# Altium project caijiban.PrjPCB (part 1 of 2)
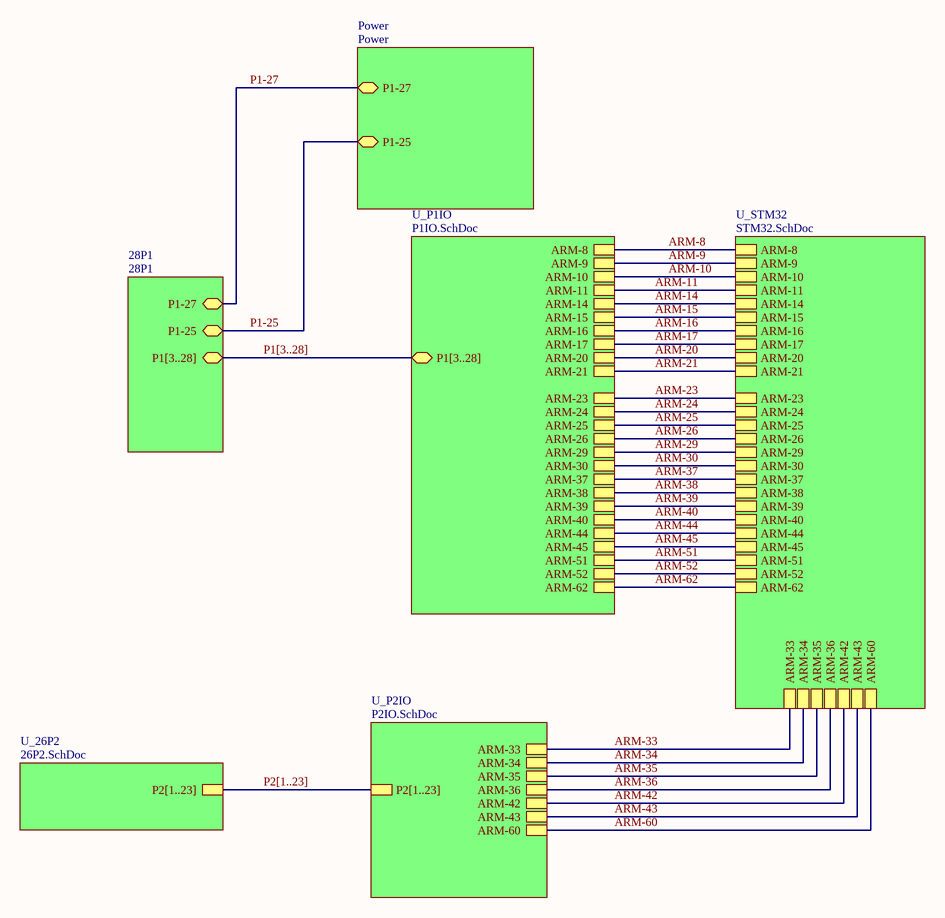
[diagram p0: TOP.SchDoc]
13 sheets, 512 parts. Net scope: global (net labels, ports and power ports of the same name join across sheets).
Sheets:
  TOP.SchDoc
    Power = Power.SchDoc
    28P1 = 28P1.SchDoc
    U_STM32 = STM32.SchDoc
    U_P1IO = P1IO.SchDoc
      U_智能四通道高端开关（1） = 智能四通道高端开关（1）.SchDoc
      U_四通道输出运算放大（2） = 四通道输出运算放大（2）.SchDoc
      U_输出运算放大(3) = 输出运算放大(3).SchDoc
      U_集成隔离器（4） = 集成隔离器（4）.SchDoc
      U_输出运算放大器（5） = 输出运算放大器（5）.SchDoc
      U_输出放大（6） = 输出放大（6）.SchDoc
    U_P2IO = P2IO.SchDoc
    U_26P2 = 26P2.SchDoc

## Sheet TOP.SchDoc
size A4

### Sub-sheets
28P1 = 28P1: P1[3..28], P1-27, P1-25
Power = Power: P1-27, P1-25
U_26P2 = 26P2.SchDoc: P2[1..23]
U_P1IO = P1IO.SchDoc: P1[3..28], ARM-37, ARM-38, ARM-39, ARM-40, ARM-51, ARM-52, ARM-9, ARM-10, ARM-11, ARM-23, ARM-24, ARM-29, ARM-30, ARM-44, ARM-45, ARM-62, ARM-14, ARM-15, ARM-16, ARM-17, ARM-20, ARM-21, ARM-25, ARM-26, ARM-8
U_P2IO = P2IO.SchDoc: ARM-36, ARM-34, ARM-33, ARM-60, P2[1..23], ARM-35, ARM-42, ARM-43
U_STM32 = STM32.SchDoc: ARM-26, ARM-29, ARM-30, ARM-33, ARM-34, ARM-35, ARM-36, ARM-37, ARM-38, ARM-39, ARM-40, ARM-52, ARM-60, ARM-62, ARM-42, ARM-43, ARM-44, ARM-45, ARM-51, ARM-20, ARM-21, ARM-23, ARM-24, ARM-25, ARM-8, ARM-9, ARM-10, ARM-11, ARM-14, ARM-15, ARM-16, ARM-17

### Nets
P1-25: sheet Power/P1-25, sheet 28P1/P1-25
P1-27: sheet Power/P1-27, sheet 28P1/P1-27
ARM-8: sheet U_STM32/ARM-8, sheet U_P1IO/ARM-8
ARM-9: sheet U_STM32/ARM-9, sheet U_P1IO/ARM-9
ARM-10: sheet U_STM32/ARM-10, sheet U_P1IO/ARM-10
ARM-11: sheet U_STM32/ARM-11, sheet U_P1IO/ARM-11
ARM-14: sheet U_STM32/ARM-14, sheet U_P1IO/ARM-14
ARM-15: sheet U_STM32/ARM-15, sheet U_P1IO/ARM-15
ARM-16: sheet U_STM32/ARM-16, sheet U_P1IO/ARM-16
ARM-17: sheet U_STM32/ARM-17, sheet U_P1IO/ARM-17
ARM-20: sheet U_STM32/ARM-20, sheet U_P1IO/ARM-20
ARM-21: sheet U_STM32/ARM-21, sheet U_P1IO/ARM-21
ARM-23: sheet U_STM32/ARM-23, sheet U_P1IO/ARM-23
ARM-24: sheet U_STM32/ARM-24, sheet U_P1IO/ARM-24
ARM-25: sheet U_STM32/ARM-25, sheet U_P1IO/ARM-25
ARM-26: sheet U_STM32/ARM-26, sheet U_P1IO/ARM-26
ARM-29: sheet U_STM32/ARM-29, sheet U_P1IO/ARM-29
ARM-30: sheet U_STM32/ARM-30, sheet U_P1IO/ARM-30
ARM-33: sheet U_STM32/ARM-33, sheet U_P2IO/ARM-33
ARM-34: sheet U_STM32/ARM-34, sheet U_P2IO/ARM-34
ARM-35: sheet U_STM32/ARM-35, sheet U_P2IO/ARM-35
ARM-36: sheet U_STM32/ARM-36, sheet U_P2IO/ARM-36
ARM-37: sheet U_STM32/ARM-37, sheet U_P1IO/ARM-37
ARM-38: sheet U_STM32/ARM-38, sheet U_P1IO/ARM-38
ARM-39: sheet U_STM32/ARM-39, sheet U_P1IO/ARM-39
ARM-40: sheet U_STM32/ARM-40, sheet U_P1IO/ARM-40
ARM-42: sheet U_STM32/ARM-42, sheet U_P2IO/ARM-42
ARM-43: sheet U_STM32/ARM-43, sheet U_P2IO/ARM-43
ARM-44: sheet U_STM32/ARM-44, sheet U_P1IO/ARM-44
ARM-45: sheet U_STM32/ARM-45, sheet U_P1IO/ARM-45
ARM-51: sheet U_STM32/ARM-51, sheet U_P1IO/ARM-51
ARM-52: sheet U_STM32/ARM-52, sheet U_P1IO/ARM-52
ARM-60: sheet U_STM32/ARM-60, sheet U_P2IO/ARM-60
ARM-62: sheet U_STM32/ARM-62, sheet U_P1IO/ARM-62

### Buses and harness runs
bus P1[3..28] = sheet 28P1/P1[3..28] = sheet U_P1IO/P1[3..28]
bus P2[1..23] = sheet U_26P2/P2[1..23] = sheet U_P2IO/P2[1..23]

## Sheet Power.SchDoc: 采集板的电源模块
size A4
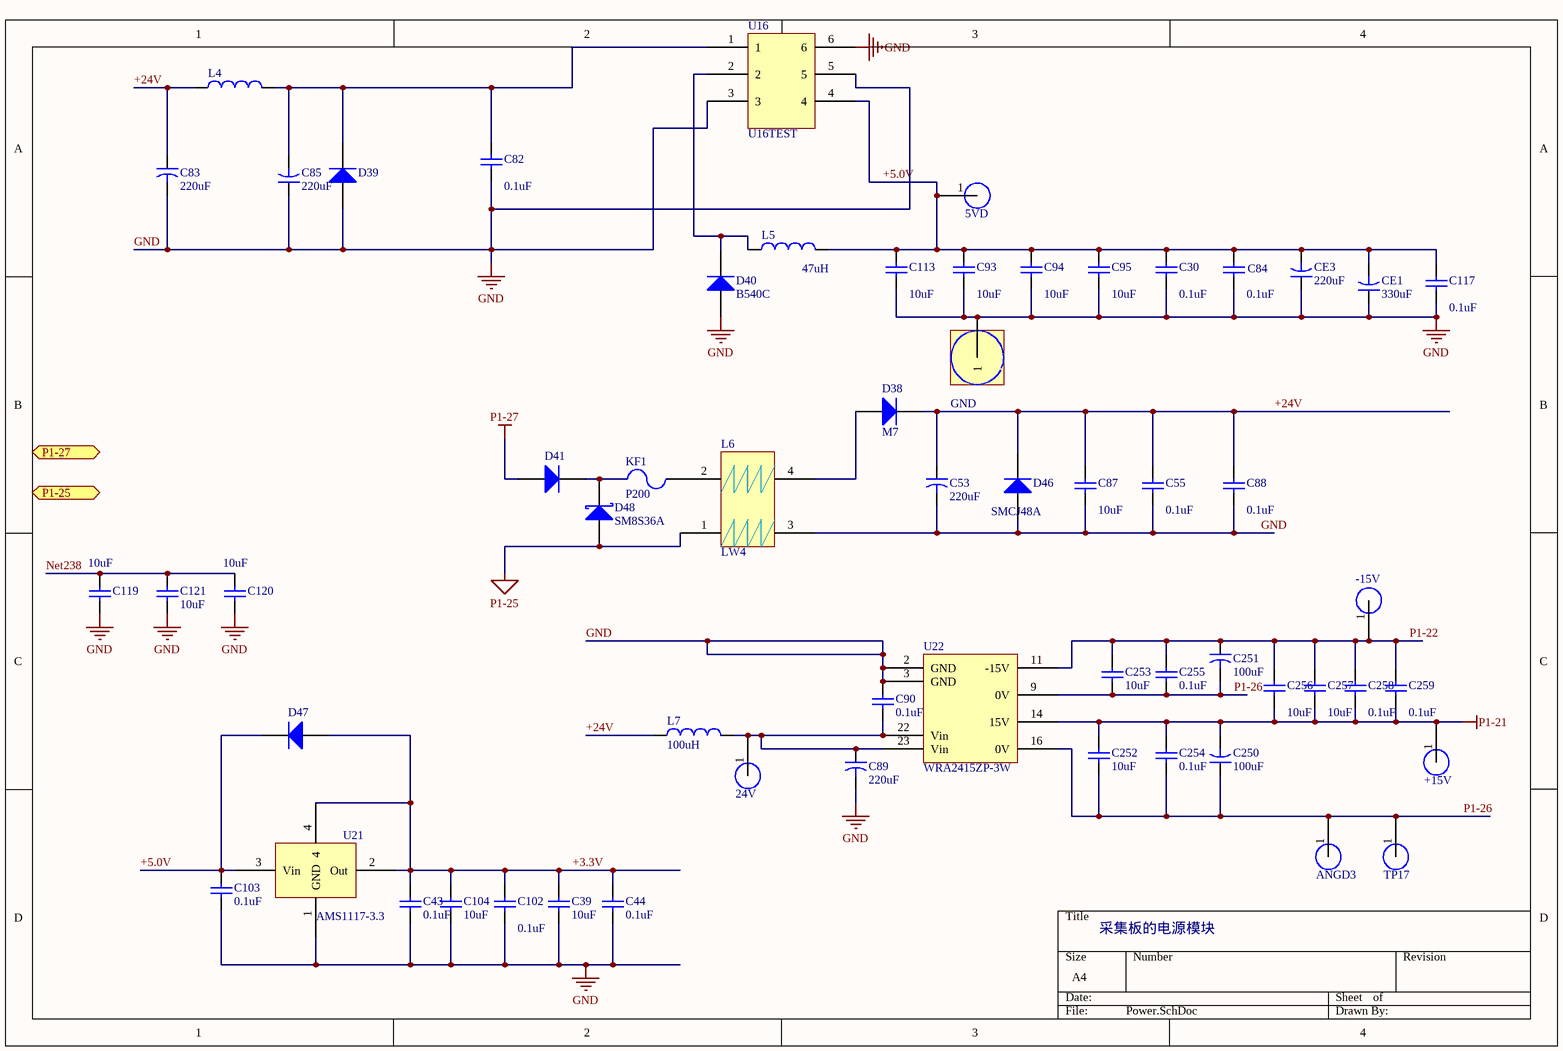
[diagram p1: Power.SchDoc]

### Parts
5VD  PIN  [圆形焊盘]  (value not drawn)
24V  PIN  [圆形焊盘]  (value not drawn)
+15V  PIN  [圆形焊盘]  (value not drawn)
-15V  PIN  [圆形焊盘]  (value not drawn)
ANGD3  PIN  [圆形焊盘]  (value not drawn)
C30  value 0.1uF  [C0805]  (hidden comment: 104/10%)
C39  value 10uF  [C1206]  (hidden comment: Cap)
C43  value 0.1uF  [C0805]  (hidden comment: 104/10%)
C44  value 0.1uF  [C0805]  (hidden comment: Cap)
C53  value 220uF  [8*12]  (hidden comment: Cap2)
C55  value 0.1uF  [C0805]  (hidden comment: 104/10%)
C82  value 0.1uF  [C0805]  (hidden comment: 22pF/5%)
C83  value 220uF  [8*12]  (hidden comment: Cap2)
C84  value 0.1uF  [C0805]  (hidden comment: 104/10%)
C85  value 220uF  [8*12]  (hidden comment: Cap2)
C87  10uF  [C1206]
C88  value 0.1uF  [C0805]  (hidden comment: 104/10%)
C89  value 220uF  [8*12]  (hidden comment: Cap2)
C90  value 0.1uF  [C0805]  (hidden comment: 104/10%)
C93  10uF  [C1206]
C94  10uF  [C1206]
C95  10uF  [C1206]
C102  value 0.1uF  [C0805]  (hidden comment: Cap)
C103  value 0.1uF  [C0805]  (hidden comment: 104/10%)
C104  value 10uF  [C1206]  (hidden comment: Cap)
C113  value 10uF  [C1206]  (hidden comment: Cap)
C117  value 0.1uF  [C0805]  (hidden comment: Cap)
C119  value 10uF  [C1210]  (hidden comment: Cap)
C120  value 10uF  [C1210]  (hidden comment: Cap)
C121  value 10uF  [C1210]  (hidden comment: Cap)
C250  value 100uF  [8*12]  (hidden comment: Cap2)
C251  value 100uF  [8*12]  (hidden comment: Cap2)
C252  10uF  [C1206]
C253  10uF  [C1206]
C254  value 0.1uF  [C0805]  (hidden comment: 104/10%)
C255  value 0.1uF  [C0805]  (hidden comment: 104/10%)
C256  10uF  [C1206]
C257  10uF  [C1206]
C258  value 0.1uF  [C0805]  (hidden comment: 104/10%)
C259  value 0.1uF  [C0805]  (hidden comment: 104/10%)
CE1  value 330uF  [8*12]  (hidden comment: Cap2)
CE3  value 220uF  [8*12]  (hidden comment: Cap2)
D38  M7  [DO214AB]
D39  SMCJ48A  [DO214AB]  (value not drawn)
D40  B540C  [DO214AB]
D41  B540C  [DO214AB]  (value not drawn)
D46  SMCJ48A  [DO214AB]
D47  Diode 1N4007  [SOD123]  (value not drawn)
D48  SM8S36A  [DO-218AB]
GND  TEST  [方形焊盘]  (value not drawn)
KF1  P200  [1812]
L4  101  [7*7]  (value not drawn)
L5  value 47uH  [12.5*12.5]  (hidden comment: SLF12575T-470M2R7-PF)
L6  LW4  [直插共模电感]
L7  value 100uH  [7*7]  (hidden comment: 101)
TP17  PIN  [圆形焊盘]  (value not drawn)
U16  U16TEST  [TOP2-63]
U21  AMS1117-3.3  [SOT-223]
U22  WRA2415ZP-3W  [WRA2415]

### Ports
P1-25, P1-27

### Nets
+3.3V: C39.1 C43.2 C44.1 C102.2 C104.1 D47.1(A) U21.2(Out) U21.4
+5.0V: 5VD.1 C30.1 C84.1 C93.1 C94.1 C95.1 C103.1 C113.2 C117.2 CE1.2 CE3.2 D47.2(K) L5.2 U16.4 U21.3(Vin)
+24V: C53.2 C55.2 C83.2 C87.2 C88.2 D38.2(K) D46.2(K) L4.1 L7.1
GND: C30.2 C39.2 C43.1 C44.2 C53.1 C55.1 C82.1 C83.1 C84.2 C85.1 C87.1 C88.1 C89.1 C90.1 C93.2 C94.2 C95.2 C102.1 C103.2 C104.2 C113.1 C117.1 C119.2 C120.2 C121.1 CE1.1 CE3.1 D39.1(A) D40.1(A) D46.1(A) GND.1 L6.3 U16.3 U16.5 U16.6 U21.1(GND) U22.2(GND) U22.3(GND)
P1-21: +15V.1 C250.2 C252.1 C254.1 C256.1 C257.1 C258.1 C259.1 U22.14(15V)
P1-22: -15V.1 C251.1 C253.1 C255.1 C256.2 C257.2 C258.2 C259.2 U22.11(-15V)
P1-25: D48.2(A) L6.1 ; port P1-25
P1-26: ANGD3.1 C250.1 C251.2 C252.2 C253.2 C254.2 C255.2 TP17.1 U22.9(0V) U22.16(0V)
P1-27: D41.1(A) ; port P1-27
Net238: C119.1 C120.1 C121.2
Net24V_1: 24V.1 C89.2 C90.2 L7.2 U22.22(Vin) U22.23(Vin)
NetC82_2: C82.2 C85.2 D39.2(K) L4.2 U16.1
NetD38_1: D38.1(A) L6.4
NetD40_2: D40.2(K) L5.1 U16.2
NetD41_2: D41.2(K) D48.1(K) KF1.2
NetKF1_1: KF1.1 L6.2

### Library data of the parts
5VD 24V +15V -15V ANGD3 GND TP17 U16 U21 = Component_1
C30 C39 C43 C44 C55 C82 C84 C87 C88 C90 C93-C95 C102-C104 C113 C117 C119-C121 C252-C259 = Cap: Capacitor; Published: 8-Jun-2000; LatestRevisionDate: 17-Jul-2002; LatestRevisionNote: Re-released for DXP Platform.; PackageReference: RAD-0.3; Publisher: Altium Limited
  C87 C93-C95 C252 C253 C256 C257: Value: 10uF
C53 C83 C85 C89 C250 C251 CE1 CE3 = Cap2: Capacitor; Published: 23-Sep-2002; PackageReference: CAPR5-4X5; Publisher: Altium Limited
D38 D40 D41 D47 = Diode 1N4007: 1 Amp General Purpose Rectifier; Published: 8-Jun-2000; LatestRevisionDate: 17-Jul-2002; LatestRevisionNote: Re-released for DXP Platform.; DatasheetDocument: 1998; PackageDocument: Aug-1999; PackageReference: DO-41; Publisher: Altium Limited; Code_JEDEC: DO-204-AL; ComponentLink1Description: Manufacturer Link; ComponentLink1URL: http://www.fairchildsemi.com/; ComponentLink2Description: Datasheet; ComponentLink2URL: http://www.fairchildsemi.com/ds/1N%2F1N4001.pdf
D39 D46 = Diode: Default Diode; Published: 8-Jun-2000; LatestRevisionDate: 17-Jul-2002; LatestRevisionNote: Re-released for DXP Platform.; PackageDocument: Sep-1996; PackageReference: SMC; Publisher: Altium Limited; Code_JEDEC: DO-214-AB
D48 = D Schottky: Schottky Diode; Published: 8-Jun-2000; LatestRevisionDate: 17-Jul-2002; LatestRevisionNote: Re-released for DXP Platform.; PackageReference: SMB; Publisher: Altium Limited; Code_JEDEC: DO-214-AA
KF1 = Fuse 2: Fuse; Published: 8-Jun-2000; LatestRevisionDate: 17-Jul-2002; LatestRevisionNote: Re-released for DXP Platform.; PackageReference: PIN-W2/E2.8; Publisher: Altium Limited
L4 = Inductor: Code_IEC: 1005; Value: 100uH; Published: 8-Jun-2000; LatestRevisionDate: 17-Jul-2002; LatestRevisionNote: Re-released for DXP Platform.; PackageReference: 0402-A; Publisher: Altium Limited; Code_JEITA: 0402
L5 L7 = Inductor: Code_IEC: 1005; Published: 8-Jun-2000; LatestRevisionDate: 17-Jul-2002; LatestRevisionNote: Re-released for DXP Platform.; PackageReference: 0402-A; Publisher: Altium Limited; Code_JEITA: 0402

## Sheet 28P1.SchDoc
size A4
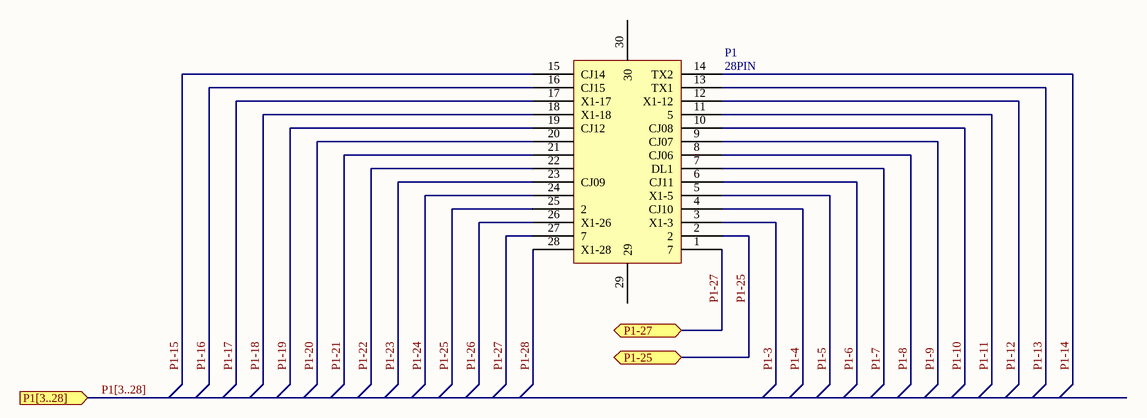
[diagram p2: 28P1.SchDoc]

### Parts
P1  28PIN  [2*14]

### Ports
P1-25, P1-27, P1[3..28]

### Nets
P1-21: P1.21
P1-22: P1.22
P1-25: P1.2 P1.25(2) ; port P1-25
P1-26: P1.26(X1-26)
P1-27: P1.1(7) P1.27(7) ; port P1-27
P1-3: P1.3(X1-3)
P1-4: P1.4(CJ10)
P1-5: P1.5(X1-5)
P1-6: P1.6(CJ11)
P1-7: P1.7(DL1)
P1-8: P1.8(CJ06)
P1-9: P1.9(CJ07)
P1-10: P1.10(CJ08)
P1-11: P1.11(5)
P1-12: P1.12(X1-12)
P1-13: P1.13(TX1)
P1-14: P1.14(TX2)
P1-15: P1.15(CJ14)
P1-16: P1.16(CJ15)
P1-17: P1.17(X1-17)
P1-18: P1.18(X1-18)
P1-19: P1.19(CJ12)
P1-20: P1.20
P1-23: P1.23(CJ09)
P1-24: P1.24
P1-28: P1.28(X1-28)

Not connected (* = marked no-connect by the designer): P1 29 30

### Buses and harness runs
bus P1[3..28] = port P1[3..28]

### Library data of the parts
P1 = Component_1

## Sheet STM32.SchDoc
size A4
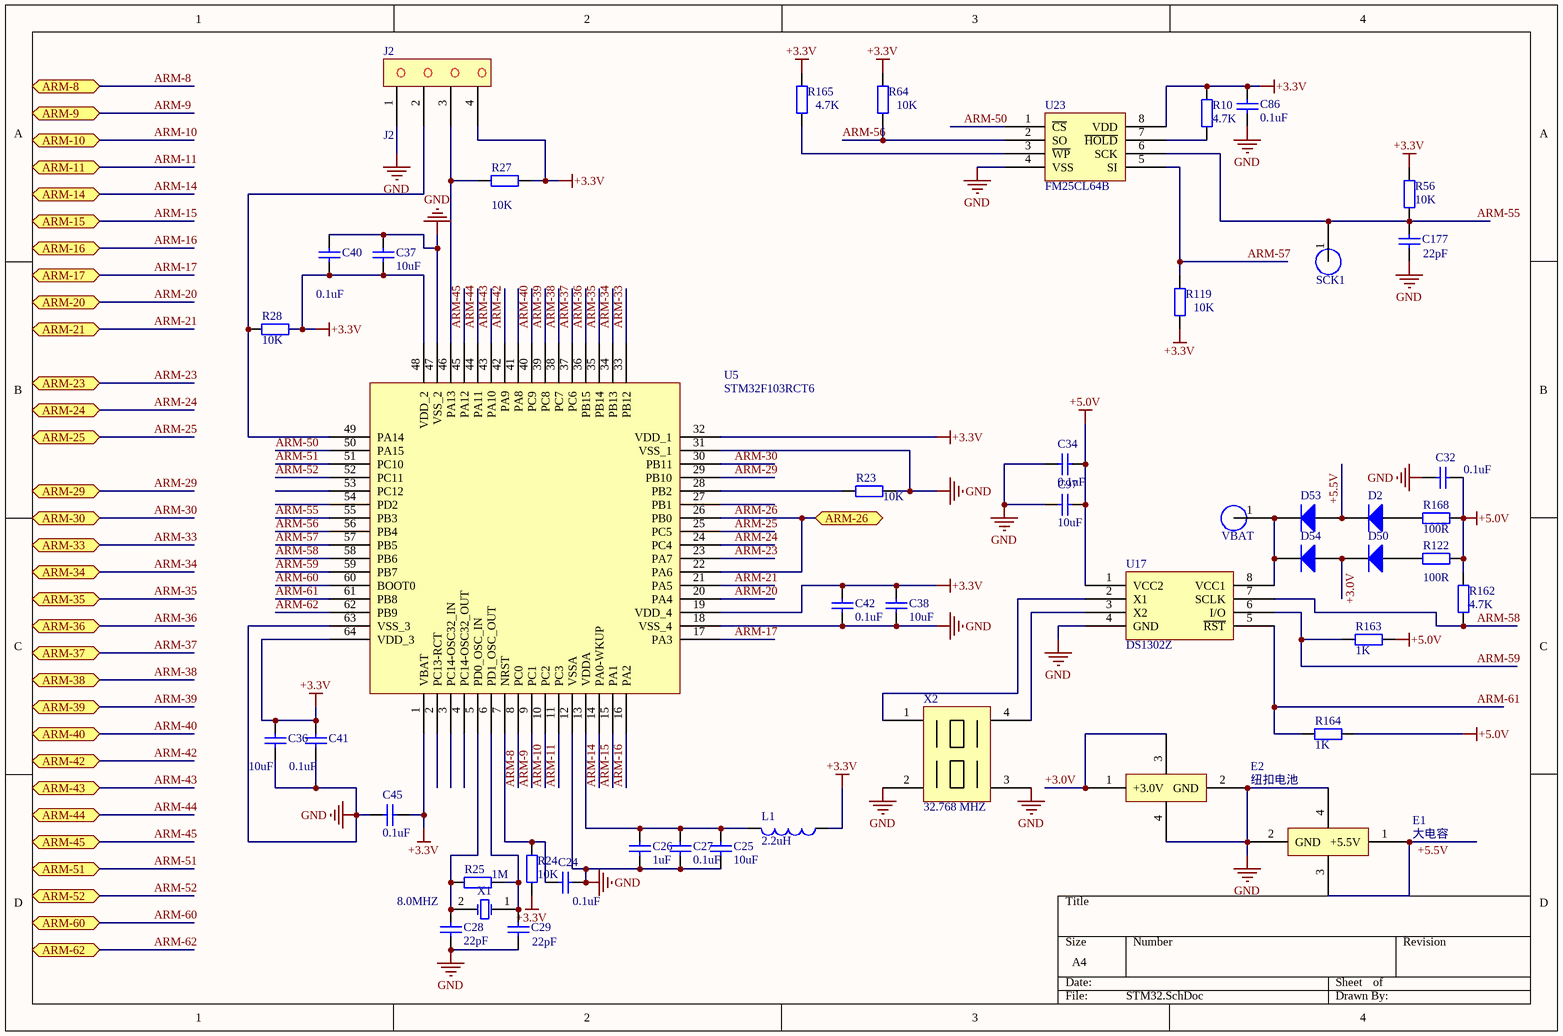
[diagram p3: STM32.SchDoc]

### Parts
C24  value 0.1uF  [C0805]  (hidden comment: Cap)
C25  value 10uF  [C1206]  (hidden comment: Cap)
C26  value 1uF  [C0805]  (hidden comment: Cap)
C27  value 0.1uF  [C0805]  (hidden comment: Cap)
C28  value 22pF  [C0805]  (hidden comment: Cap)
C29  value 22pF  [C0805]  (hidden comment: Cap)
C32  value 0.1uF  [C0805]  (hidden comment: Cap)
C34  value 0.1uF  [C0805]  (hidden comment: Cap)
C36  value 10uF  [C1206]  (hidden comment: Cap)
C37  value 10uF  [C1206]  (hidden comment: Cap)
C38  value 10uF  [C1206]  (hidden comment: Cap)
C40  value 0.1uF  [C0805]  (hidden comment: Cap)
C41  value 0.1uF  [C0805]  (hidden comment: Cap)
C42  value 0.1uF  [C0805]  (hidden comment: Cap)
C45  value 0.1uF  [C0805]  (hidden comment: Cap)
C86  value 0.1uF  [C86单独封装]  (hidden comment: Cap)
C97  value 10uF  [C1206]  (hidden comment: Cap)
C177  value 22pF  [C0805]  (hidden comment: Cap)
D2  Diode 1N4001  [SOD123]  (value not drawn)
D50  Diode 1N4001  [SOD123]  (value not drawn)
D53  Diode 1N4001  [SOD123]  (value not drawn)
D54  Diode 1N4001  [SOD123]  (value not drawn)
E1  大电容  [法拉电容电池]
E2  纽扣电池  [法拉电容电池]
J2  J2  [J2DIP]
L1  value 2.2uH  [R0805]  (hidden comment: Inductor)
R10  value 4.7K  [R0805]  (hidden comment: Res2)
R23  value 10K  [R0805]  (hidden comment: Res2)
R24  value 10K  [R0805]  (hidden comment: Res2)
R25  value 1M  [R0805]  (hidden comment: Res2)
R27  value 10K  [R0805]  (hidden comment: Res2)
R28  value 10K  [R0805]  (hidden comment: Res2)
R56  value 10K  [R0805]  (hidden comment: Res2)
R64  value 10K  [R0805]  (hidden comment: Res2)
R119  value 10K  [R0805]  (hidden comment: Res2)
R122  value 100R  [R1206]  (hidden comment: Res2)
R162  value 4.7K  [R0805]  (hidden comment: Res2)
R163  value 1K  [R0805]  (hidden comment: Res2)
R164  value 1K  [R0805]  (hidden comment: Res2)
R165  value 4.7K  [R0805]  (hidden comment: Res2)
R168  value 100R  [R1206]  (hidden comment: Res2)
SCK1  PIN  [圆形焊盘]  (value not drawn)
U5  STM32F103RCT6  [LQFP64]
U17  DS1302Z  [SOP-8]
U23  FM25CL64B  [SOIC-8]
VBAT  PIN  [圆形焊盘]  (value not drawn)
X1  value 8.0MHZ  [5032-2P]  (hidden comment: XTAL)
X2  32.768 MHZ  [黑色3*8-4]

### Ports
ARM-8, ARM-9, ARM-10, ARM-11, ARM-14, ARM-15, ARM-16, ARM-17, ARM-20, ARM-21, ARM-23, ARM-24, ARM-25, ARM-26, ARM-29, ARM-30, ARM-33, ARM-34, ARM-35, ARM-36, ARM-37, ARM-38, ARM-39, ARM-40, ARM-42, ARM-43, ARM-44, ARM-45, ARM-51, ARM-52, ARM-60, ARM-62

### Nets
+3.3V: C36.2 C37.2 C38.2 C40.1 C41.1 C42.2 C45.1 C86.2 J2.4 L1.1 R10.1 R24.1 R27.2 R28.2 R56.1 R64.2 R119.1 R165.2 U5.1(VBAT) U5.19(VDD_4) U5.32(VDD_1) U5.48(VDD_2) U5.64(VDD_3) U23.8(VDD)
+5.0V: C32.2 C34.1 C97.1 R122.2 R162.1 R163.1 R164.2 R168.1 U17.1(VCC2)
GND: C24.1 C25.1 C26.1 C27.1 C28.2 C29.1 C32.1 C34.2 C36.1 C37.1 C38.1 C40.2 C41.2 C42.1 C45.2 C86.1 C97.2 C177.2 E1.2(GND) E1.4 E2.2(GND) E2.4 J2.1 R23.2 U5.12(VSSA) U5.18(VSS_4) U5.31(VSS_1) U5.47(VSS_2) U5.63(VSS_3) U17.4(GND) U23.4(VSS) X2.2 X2.3
+3.0V: D50.2(K) D54.1(A) E2.1(+3.0V) E2.3
+5.5V: D2.2(K) D53.1(A) E1.1(+5.5V) E1.3
ARM-8: U5.8(PC0) ; port ARM-8
ARM-9: U5.9(PC1) ; port ARM-9
ARM-10: U5.10(PC2) ; port ARM-10
ARM-11: U5.11(PC3) ; port ARM-11
ARM-14: U5.14(PA0-WKUP) ; port ARM-14
ARM-15: U5.15(PA1) ; port ARM-15
ARM-16: U5.16(PA2) ; port ARM-16
ARM-17: U5.17(PA3) ; port ARM-17
ARM-20: U5.20(PA4) ; port ARM-20
ARM-21: U5.21(PA5) ; port ARM-21
ARM-23: U5.23(PA7) ; port ARM-23
ARM-24: U5.24(PC4) ; port ARM-24
ARM-25: U5.25(PC5) ; port ARM-25
ARM-26: U5.22(PA6) U5.26(PB0) ; port ARM-26
ARM-29: U5.29(PB10) ; port ARM-29
ARM-30: U5.30(PB11) ; port ARM-30
ARM-33: U5.33(PB12) ; port ARM-33
ARM-34: U5.34(PB13) ; port ARM-34
ARM-35: U5.35(PB14) ; port ARM-35
ARM-36: U5.36(PB15) ; port ARM-36
ARM-37: U5.37(PC6) ; port ARM-37
ARM-38: U5.38(PC7) ; port ARM-38
ARM-39: U5.39(PC8) ; port ARM-39
ARM-40: U5.40(PC9) ; port ARM-40
ARM-42: U5.42(PA9) ; port ARM-42
ARM-43: U5.43(PA10) ; port ARM-43
ARM-44: U5.44(PA11) ; port ARM-44
ARM-45: U5.45(PA12) ; port ARM-45
ARM-50: U5.50(PA15) U23.1(~{CS})
ARM-51: U5.51(PC10) ; port ARM-51
ARM-52: U5.52(PC11) ; port ARM-52
ARM-55: C177.1 R56.2 SCK1.1 U5.55(PB3) U23.6(SCK)
ARM-56: R64.1 U5.56(PB4) U23.2(SO)
ARM-57: R119.2 U5.57(PB5) U23.5(SI)
ARM-58: R162.2 U5.58(PB6) U17.7(SCLK)
ARM-59: R163.2 U5.59(PB7) U17.6(I/O)
ARM-60: U5.60(BOOT0) ; port ARM-60
ARM-61: R164.1 U5.61(PB8) U17.5(~{RST})
ARM-62: U5.62(PB9) ; port ARM-62
NetC24_2: C24.2 R24.2 U5.7(NRST)
NetC25_2: C25.2 C26.2 C27.2 L1.2 U5.13(VDDA)
NetC28_1: C28.1 R25.2 U5.5(PD0_OSC_IN) X1.2(OSC2)
NetC29_2: C29.2 R25.1 U5.6(PD1_OSC_OUT) X1.1(OSC1)
NetD2_1: D2.1(A) R168.2
NetD50_1: D50.1(A) R122.1
NetD53_2: D53.2(K) D54.2(K) U17.8(VCC1) VBAT.1
NetJ2_2: J2.2 R28.1 U5.49(PA14)
NetJ2_3: J2.3 R27.1 U5.46(PA13)
NetR10_2: R10.2 U23.7(~{HOLD})
NetR23_1: R23.1 U5.28(PB2)
NetR165_1: R165.1 U23.3(~{WP})
NetU17_2: U17.2(X1) X2.1
NetU17_3: U17.3(X2) X2.4

Not connected (* = marked no-connect by the designer): U5 2(PC13-RCT) 3(PC14-OSC32_IN) 4(PC14-OSC32_OUT) 27(PB1) 41(PA8) 53(PC12) 54(PD2)

### Library data of the parts
C24-C29 C32 C34 C36-C38 C40-C42 C45 C86 C97 C177 = Cap: Capacitor; Published: 8-Jun-2000; LatestRevisionDate: 17-Jul-2002; LatestRevisionNote: Re-released for DXP Platform.; PackageReference: RAD-0.3; Publisher: Altium Limited
D2 D50 D53 D54 = Diode 1N4001: 1 Amp General Purpose Rectifier; Published: 8-Jun-2000; LatestRevisionDate: 17-Jul-2002; LatestRevisionNote: Re-released for DXP Platform.; DatasheetDocument: 1998; PackageDocument: Aug-1999; PackageReference: DO-41; Publisher: Altium Limited; Code_JEDEC: DO-204-AL; ComponentLink1Description: Manufacturer Link; ComponentLink1URL: http://www.fairchildsemi.com/; ComponentLink2Description: Datasheet; ComponentLink2URL: http://www.fairchildsemi.com/ds/1N%2F1N4001.pdf
E1 E2 J2 SCK1 U5 U17 U23 VBAT = Component_1
L1 = Inductor: Code_IEC: 1005; Published: 8-Jun-2000; LatestRevisionDate: 17-Jul-2002; LatestRevisionNote: Re-released for DXP Platform.; PackageReference: 0402-A; Publisher: Altium Limited; Code_JEITA: 0402
R10 R23-R25 R27 R28 R56 R64 R119 R122 R162-R165 R168 = Res2: Resistor; Published: 8-Jun-2000; LatestRevisionDate: 17-Jul-2002; LatestRevisionNote: Re-released for DXP Platform.; PackageReference: AXIAL-0.4; Publisher: Altium Limited
X1 = XTAL: Crystal Oscillator; Published: 8-Jun-2000; LatestRevisionDate: 17-Jul-2002; LatestRevisionNote: Re-released for DXP Platform.; PackageReference: R38; Publisher: Altium Limited
X2 = Component_1: Value: 23.768MHZ

## Sheet P1IO.SchDoc
size A4
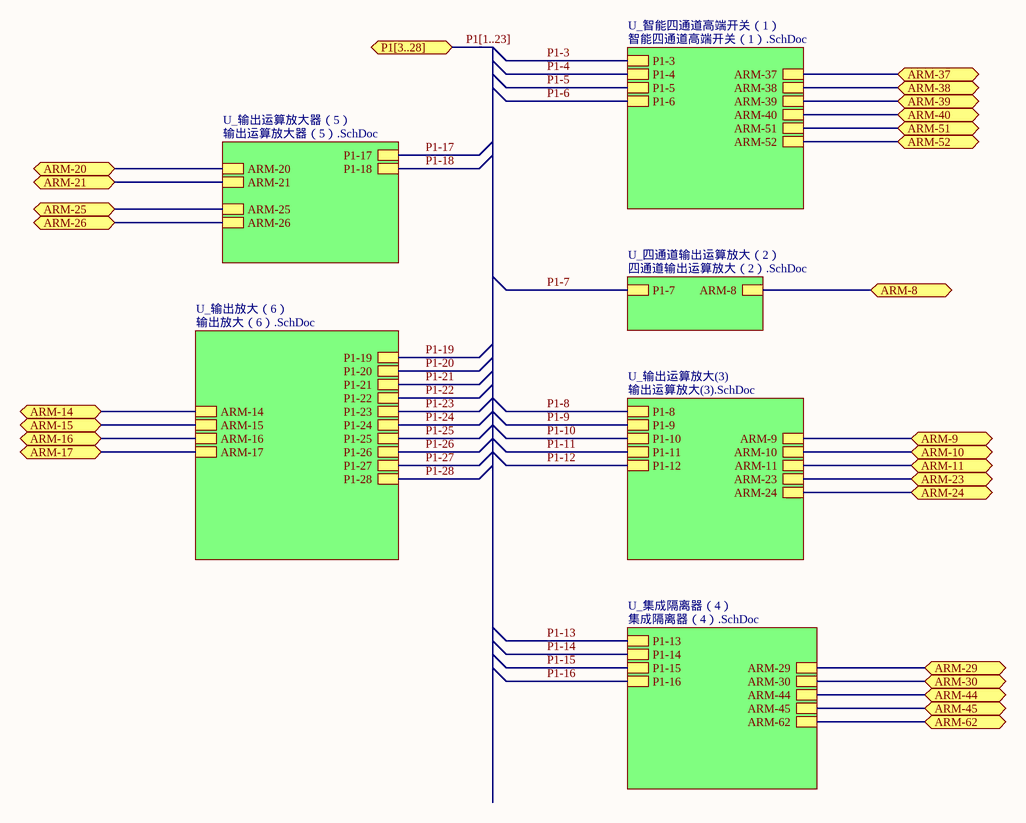
[diagram p4: P1IO.SchDoc]

### Sub-sheets
U_四通道输出运算放大（2） = 四通道输出运算放大（2）.SchDoc: P1-7, ARM-8
U_智能四通道高端开关（1） = 智能四通道高端开关（1）.SchDoc: P1-3, ARM-52, ARM-38, ARM-51, ARM-37, ARM-40, ARM-39, P1-4, P1-5, P1-6
U_输出放大（6） = 输出放大（6）.SchDoc: P1-19, P1-20, P1-21, P1-22, P1-23, P1-24, P1-25, P1-26, P1-27, P1-28, ARM-14, ARM-15, ARM-16, ARM-17
U_输出运算放大(3) = 输出运算放大(3).SchDoc: P1-8, ARM-11, P1-9, P1-10, P1-11, P1-12, ARM-9, ARM-24, ARM-23, ARM-10
U_输出运算放大器（5） = 输出运算放大器（5）.SchDoc: P1-17, P1-18, ARM-25, ARM-20, ARM-21, ARM-26
U_集成隔离器（4） = 集成隔离器（4）.SchDoc: P1-13, P1-14, P1-15, P1-16, ARM-62, ARM-30, ARM-29, ARM-44, ARM-45

### Ports
ARM-8, ARM-9, ARM-10, ARM-11, ARM-14, ARM-15, ARM-16, ARM-17, ARM-20, ARM-21, ARM-23, ARM-24, ARM-25, ARM-26, ARM-29, ARM-30, ARM-37, ARM-38, ARM-39, ARM-40, ARM-44, ARM-45, ARM-51, ARM-52, ARM-62, P1[3..28]

### Nets
ARM-8: port ARM-8, sheet U_四通道输出运算放大（2）/ARM-8
ARM-9: port ARM-9, sheet U_输出运算放大(3)/ARM-9
ARM-10: port ARM-10, sheet U_输出运算放大(3)/ARM-10
ARM-11: port ARM-11, sheet U_输出运算放大(3)/ARM-11
ARM-14: port ARM-14, sheet U_输出放大（6）/ARM-14
ARM-15: port ARM-15, sheet U_输出放大（6）/ARM-15
ARM-16: port ARM-16, sheet U_输出放大（6）/ARM-16
ARM-17: port ARM-17, sheet U_输出放大（6）/ARM-17
ARM-20: port ARM-20, sheet U_输出运算放大器（5）/ARM-20
ARM-21: port ARM-21, sheet U_输出运算放大器（5）/ARM-21
ARM-23: port ARM-23, sheet U_输出运算放大(3)/ARM-23
ARM-24: port ARM-24, sheet U_输出运算放大(3)/ARM-24
ARM-25: port ARM-25, sheet U_输出运算放大器（5）/ARM-25
ARM-26: port ARM-26, sheet U_输出运算放大器（5）/ARM-26
ARM-29: port ARM-29, sheet U_集成隔离器（4）/ARM-29
ARM-30: port ARM-30, sheet U_集成隔离器（4）/ARM-30
ARM-37: port ARM-37, sheet U_智能四通道高端开关（1）/ARM-37
ARM-38: port ARM-38, sheet U_智能四通道高端开关（1）/ARM-38
ARM-39: port ARM-39, sheet U_智能四通道高端开关（1）/ARM-39
ARM-40: port ARM-40, sheet U_智能四通道高端开关（1）/ARM-40
ARM-44: port ARM-44, sheet U_集成隔离器（4）/ARM-44
ARM-45: port ARM-45, sheet U_集成隔离器（4）/ARM-45
ARM-51: port ARM-51, sheet U_智能四通道高端开关（1）/ARM-51
ARM-52: port ARM-52, sheet U_智能四通道高端开关（1）/ARM-52
ARM-62: port ARM-62, sheet U_集成隔离器（4）/ARM-62

### Buses and harness runs
bus P1[1..23] = port P1[3..28]

## Sheet 智能四通道高端开关（1）.SchDoc
size A4
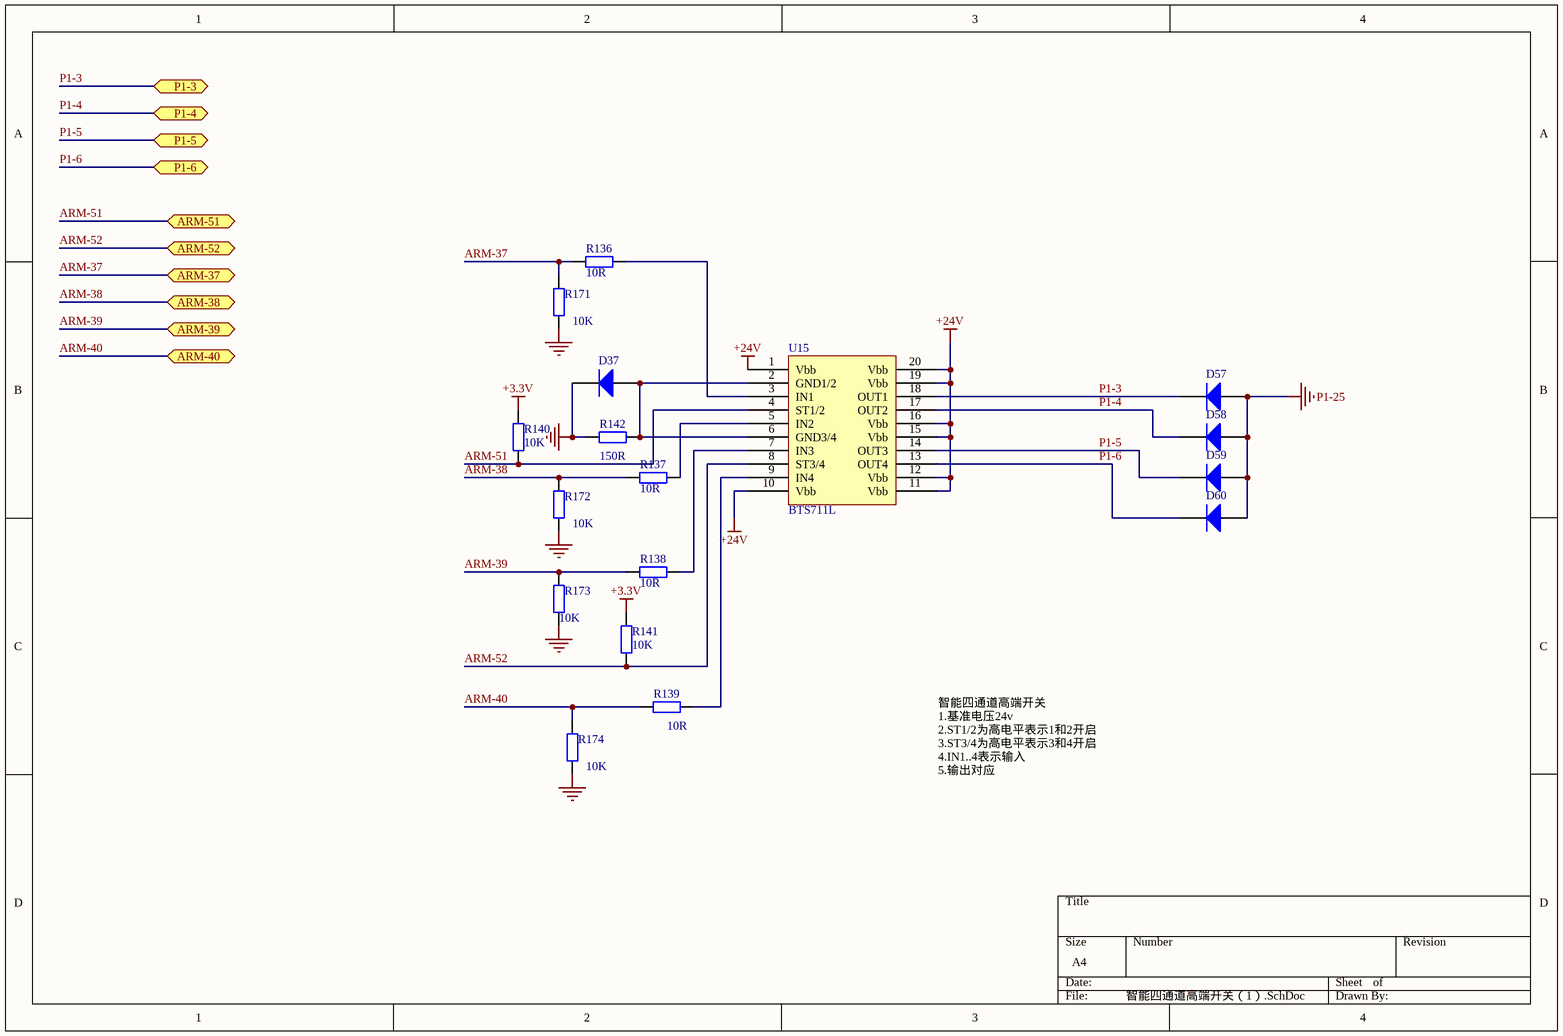
[diagram p5: 智能四通道高端开关（1）.SchDoc]

### Parts
D37  Diode 1N4007  [SOD123]  (value not drawn)
D57  Diode 1N4007  [DO214AB]  (value not drawn)
D58  Diode 1N4007  [DO214AB]  (value not drawn)
D59  Diode 1N4007  [DO214AB]  (value not drawn)
D60  Diode 1N4007  [DO214AB]  (value not drawn)
R136  value 10R  [R0805]  (hidden comment: Res2)
R137  value 10R  [R0805]  (hidden comment: Res2)
R138  value 10R  [R0805]  (hidden comment: Res2)
R139  value 10R  [R0805]  (hidden comment: Res2)
R140  value 10K  [R0805]  (hidden comment: Res2)
R141  value 10K  [R0805]  (hidden comment: Res2)
R142  value 150R  [R0805]  (hidden comment: Res2)
R171  value 10K  [R0805]  (hidden comment: Res2)
R172  value 10K  [R0805]  (hidden comment: Res2)
R173  value 10K  [R0805]  (hidden comment: Res2)
R174  value 10K  [R0805]  (hidden comment: Res2)
U15  BTS711L  [SOP-20]

### Ports
ARM-37, ARM-38, ARM-39, ARM-40, ARM-51, ARM-52, P1-3, P1-4, P1-5, P1-6

### Nets
+3.3V: R140.1 R141.1
+24V: U15.1(Vbb) U15.10(Vbb) U15.11(Vbb) U15.12(Vbb) U15.15(Vbb) U15.16(Vbb) U15.19(Vbb) U15.20(Vbb)
GND: D37.2(K) R142.1 R171.1 R172.1 R173.1 R174.1
P1-25: D57.1(A) D58.1(A) D59.1(A) D60.1(A)
ARM-37: R136.2 R171.2 ; port ARM-37
ARM-38: R137.2 R172.2 ; port ARM-38
ARM-39: R138.2 R173.2 ; port ARM-39
ARM-40: R139.2 R174.2 ; port ARM-40
ARM-51: R140.2 U15.4(ST1/2) ; port ARM-51
ARM-52: R141.2 U15.8(ST3/4) ; port ARM-52
P1-3: D57.2(K) U15.18(OUT1) ; port P1-3
P1-4: D58.2(K) U15.17(OUT2) ; port P1-4
P1-5: D59.2(K) U15.14(OUT3) ; port P1-5
P1-6: D60.2(K) U15.13(OUT4) ; port P1-6
NetD37_1: D37.1(A) R142.2 U15.2(GND1/2) U15.6(GND3/4)
NetR136_1: R136.1 U15.3(IN1)
NetR137_1: R137.1 U15.5(IN2)
NetR138_1: R138.1 U15.7(IN3)
NetR139_1: R139.1 U15.9(IN4)

### Notes on the sheet
- 智能四通道高端开关
  1.基准电压24v
  2.ST1/2为高电平表示1和2开启
  3.ST3/4为高电平表示3和4开启
  4.IN1..4表示输入
  5.输出对应

### Library data of the parts
D37 D57-D60 = Diode 1N4007: 1 Amp General Purpose Rectifier; Published: 8-Jun-2000; LatestRevisionDate: 17-Jul-2002; LatestRevisionNote: Re-released for DXP Platform.; DatasheetDocument: 1998; PackageDocument: Aug-1999; PackageReference: DO-41; Publisher: Altium Limited; Code_JEDEC: DO-204-AL; ComponentLink1Description: Manufacturer Link; ComponentLink1URL: http://www.fairchildsemi.com/; ComponentLink2Description: Datasheet; ComponentLink2URL: http://www.fairchildsemi.com/ds/1N%2F1N4001.pdf
R136-R142 R171-R174 = Res2: Resistor; Published: 8-Jun-2000; LatestRevisionDate: 17-Jul-2002; LatestRevisionNote: Re-released for DXP Platform.; PackageReference: AXIAL-0.4; Publisher: Altium Limited
U15 = Component_1

## Sheet 四通道输出运算放大（2）.SchDoc
size A4
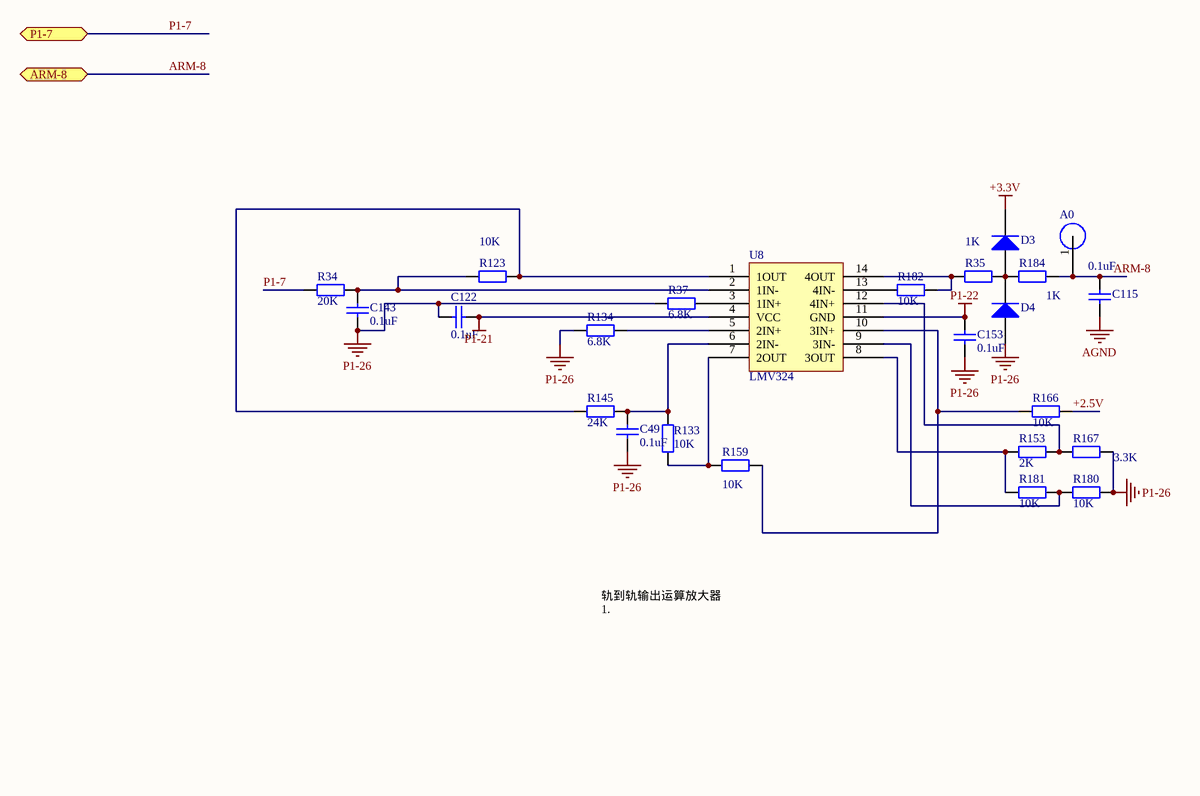
[diagram p6: 四通道输出运算放大（2）.SchDoc]

### Parts
A0  PIN  [圆形焊盘]  (value not drawn)
C49  value 0.1uF  [C0805]  (hidden comment: Cap)
C115  value 0.1uF  [C0805]  (hidden comment: Cap)
C122  value 0.1uF  [C0805]  (hidden comment: Cap)
C143  value 0.1uF  [C0805]  (hidden comment: Cap)
C153  value 0.1uF  [C0805]  (hidden comment: Cap)
D3  Diode 1N4007  [SOD123]  (value not drawn)
D4  Diode 1N4007  [SOD123]  (value not drawn)
R34  value 20K  [R0805]  (hidden comment: Res2)
R35  value 1K  [R0805]  (hidden comment: Res2)
R37  value 6.8K  [R0805]  (hidden comment: Res2)
R123  value 10K  [R0805]  (hidden comment: Res2)
R133  value 10K  [R0805]  (hidden comment: Res2)
R134  value 6.8K  [R0805]  (hidden comment: Res2)
R145  value 24K  [R0805]  (hidden comment: Res2)
R153  value 2K  [R0805]  (hidden comment: Res2)
R159  value 10K  [R0805]  (hidden comment: Res2)
R166  value 10K  [R0805]  (hidden comment: Res2)
R167  value 3.3K  [R0805]  (hidden comment: Res2)
R180  value 10K  [R0805]  (hidden comment: Res2)
R181  value 10K  [R0805]  (hidden comment: Res2)
R182  value 10K  [R0805]  (hidden comment: Res2)
R184  value 1K  [R0805]  (hidden comment: Res2)
U8  LMV324  [SOP-14]

### Ports
ARM-8, P1-7

### Nets
+2.5V: R166.1
+3.3V: D3.2(K)
AGND: C115.1
P1-21: C122.2 U8.4(VCC)
P1-22: C153.1 U8.11(GND)
P1-26: C49.2 C122.1 C143.2 C153.2 D4.1(A) R37.1 R134.1 R167.2 R180.1
ARM-8: A0.1 C115.2 R184.2 ; port ARM-8
P1-7: R34.1 ; port P1-7
NetC49_1: C49.1 R133.2 R145.2 U8.6(2IN-)
NetC143_1: C143.1 R34.2 R123.2 U8.2(1IN-)
NetD3_1: D3.1(A) D4.2(K) R35.2 R184.1
NetR35_1: R35.1 R182.1 U8.14(4OUT)
NetR37_2: R37.2 U8.3(1IN+)
NetR123_1: R123.1 R145.1 U8.1(1OUT)
NetR133_1: R133.1 R159.1 U8.7(2OUT)
NetR134_2: R134.2 U8.5(2IN+)
NetR153_1: R153.1 R167.1 U8.12(4IN+)
NetR153_2: R153.2 R181.2 U8.8(3OUT)
NetR159_2: R159.2 R166.2 U8.10(3IN+)
NetR180_2: R180.2 R181.1 U8.9(3IN-)
NetR182_2: R182.2 U8.13(4IN-)

### Notes on the sheet
- 轨到轨输出运算放大器
  1.

### Library data of the parts
A0 U8 = Component_1
C49 C115 C122 C143 C153 = Cap: Capacitor; Published: 8-Jun-2000; LatestRevisionDate: 17-Jul-2002; LatestRevisionNote: Re-released for DXP Platform.; PackageReference: RAD-0.3; Publisher: Altium Limited
D3 D4 = Diode 1N4007: 1 Amp General Purpose Rectifier; Published: 8-Jun-2000; LatestRevisionDate: 17-Jul-2002; LatestRevisionNote: Re-released for DXP Platform.; DatasheetDocument: 1998; PackageDocument: Aug-1999; PackageReference: DO-41; Publisher: Altium Limited; Code_JEDEC: DO-204-AL; ComponentLink1Description: Manufacturer Link; ComponentLink1URL: http://www.fairchildsemi.com/; ComponentLink2Description: Datasheet; ComponentLink2URL: http://www.fairchildsemi.com/ds/1N%2F1N4001.pdf
R34 R35 R37 R123 R133 R134 R145 R153 R159 R166 R167 R180-R182 R184 = Res2: Resistor; Published: 8-Jun-2000; LatestRevisionDate: 17-Jul-2002; LatestRevisionNote: Re-released for DXP Platform.; PackageReference: AXIAL-0.4; Publisher: Altium Limited

## Sheet 输出运算放大(3).SchDoc
size A4
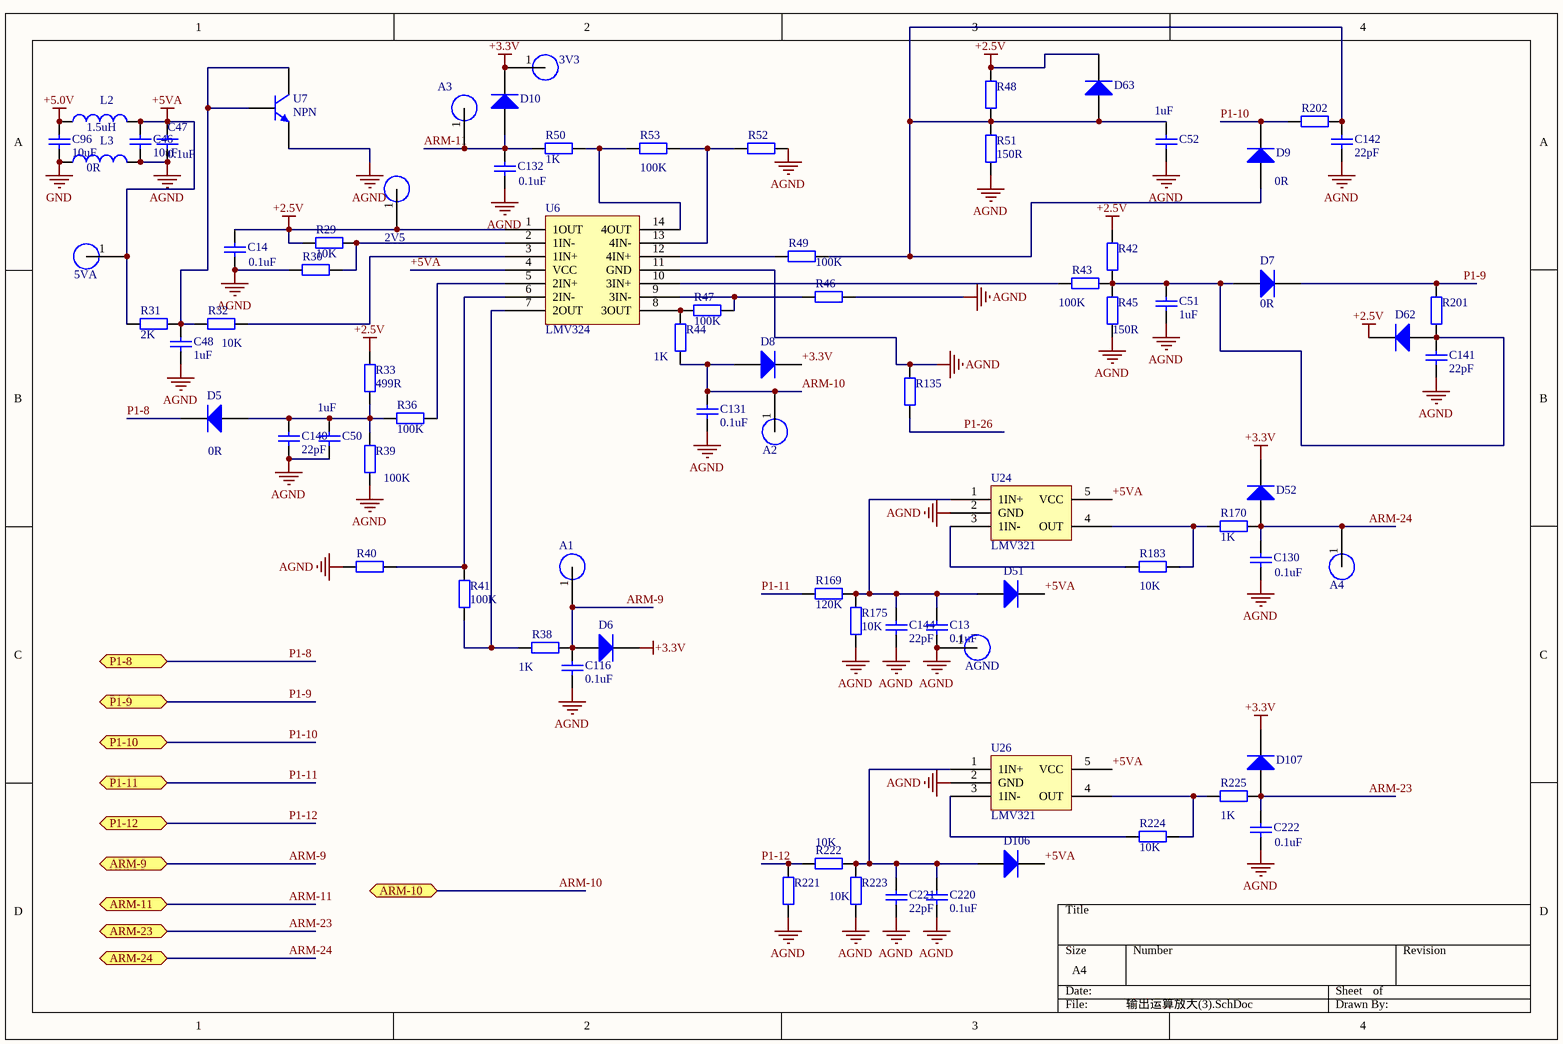
[diagram p7: 输出运算放大(3).SchDoc]

### Parts
2V5  PIN  [圆形焊盘]  (value not drawn)
3V3  PIN  [圆形焊盘]  (value not drawn)
5VA  PIN  [圆形焊盘]  (value not drawn)
A1  PIN  [圆形焊盘]  (value not drawn)
A2  PIN  [圆形焊盘]  (value not drawn)
A3  PIN  [圆形焊盘]  (value not drawn)
A4  PIN  [圆形焊盘]  (value not drawn)
AGND  PIN  [圆形焊盘]  (value not drawn)
C13  value 0.1uF  [C0805]  (hidden comment: Cap)
C14  value 0.1uF  [C0805]  (hidden comment: Cap)
C46  value 10uF  [C1206]  (hidden comment: Cap)
C47  value 0.1uF  [C0805]  (hidden comment: Cap)
C48  value 1uF  [C0805]  (hidden comment: Cap)
C50  value 1uF  [C0805]  (hidden comment: Cap)
C51  value 1uF  [C0805]  (hidden comment: Cap)
C52  value 1uF  [C0805]  (hidden comment: Cap)
C96  value 10uF  [C1206]  (hidden comment: Cap)
C116  value 0.1uF  [C0805]  (hidden comment: Cap)
C130  value 0.1uF  [C0805]  (hidden comment: Cap)
C131  value 0.1uF  [C0805]  (hidden comment: Cap)
C132  value 0.1uF  [C0805]  (hidden comment: Cap)
C140  value 22pF  [C0805]  (hidden comment: Cap)
C141  value 22pF  [C0805]  (hidden comment: Cap)
C142  value 22pF  [C0805]  (hidden comment: Cap)
C144  value 22pF  [C0805]  (hidden comment: Cap)
C220  value 0.1uF  [C0805]  (hidden comment: Cap)
C221  value 22pF  [C0805]  (hidden comment: Cap)
C222  value 0.1uF  [C0805]  (hidden comment: Cap)
D5  value 0R  [SOD123]  (hidden comment: Diode 1N4007)
D6  Diode 1N4007  [SOD123]  (value not drawn)
D7  value 0R  [SOD123]  (hidden comment: Diode 1N4007)
D8  Diode 1N4007  [SOD123]  (value not drawn)
D9  value 0R  [SOD123]  (hidden comment: Diode 1N4007)
D10  Diode 1N4007  [SOD123]  (value not drawn)
D51  Diode 1N4007  [SOD123]  (value not drawn)
D52  Diode 1N4007  [SOD123]  (value not drawn)
D62  Diode 1N4007  [SOD123]  (value not drawn)
D63  Diode 1N4007  [SOD123]  (value not drawn)
D106  Diode 1N4007  [SOD123]  (value not drawn)
D107  Diode 1N4007  [SOD123]  (value not drawn)
L2  value 1.5uH  [C1206]  (hidden comment: Inductor)
L3  value 0R  [R1206]  (hidden comment: Inductor)
R29  value 10K  [R0805]  (hidden comment: Res2)
R30  Res2  [R0805]  (value not drawn)
R31  value 2K  [R0805]  (hidden comment: Res2)
R32  value 10K  [R0805]  (hidden comment: Res2)
R33  value 499R  [R0805]  (hidden comment: Res2)
R36  value 100K  [R0805]  (hidden comment: Res2)
R38  value 1K  [R0805]  (hidden comment: Res2)
R39  value 100K  [R0805]  (hidden comment: Res2)
R40  Res2  [R0805]  (value not drawn)
R41  value 100K  [R0805]  (hidden comment: Res2)
R42  Res2  [R0805]  (value not drawn)
R43  value 100K  [R0805]  (hidden comment: Res2)
R44  value 1K  [R0805]  (hidden comment: Res2)
R45  value 150R  [R0805]  (hidden comment: 150)
R46  Res2  [R0805]  (value not drawn)
R47  value 100K  [R0805]  (hidden comment: Res2)
R48  Res2  [R0805]  (value not drawn)
R49  value 100K  [R0805]  (hidden comment: Res2)
R50  value 1K  [R0805]  (hidden comment: Res2)
R51  value 150R  [R0805]  (hidden comment: Res2)
R52  Res2  [R0805]  (value not drawn)
R53  value 100K  [R0805]  (hidden comment: Res2)
R135  Res2  [R0805]  (value not drawn)
R169  value 120K  [R0805]  (hidden comment: Res2)
R170  value 1K  [R0805]  (hidden comment: Res2)
R175  value 10K  [R0805]  (hidden comment: Res2)
R183  value 10K  [R0805]  (hidden comment: Res2)
R201  Res2  [R0805]  (value not drawn)
R202  Res2  [R0805]  (value not drawn)
R221  Res2  [R0805]  (value not drawn)
R222  value 10K  [R0805]  (hidden comment: Res2)
R223  value 10K  [R0805]  (hidden comment: Res2)
R224  value 10K  [R0805]  (hidden comment: Res2)
R225  value 1K  [R0805]  (hidden comment: Res2)
U6  LMV324  [SOP-14]
U7  NPN  [SOT23-3]
U24  LMV321  [SOT23-5]
U26  LMV321  [SOT23-5]

### Ports
ARM-9, ARM-10, ARM-11, ARM-23, ARM-24, P1-8, P1-9, P1-10, P1-11, P1-12

### Nets
+2.5V: 2V5.1 C14.2 D62.2(K) D63.2(K) R29.2 R33.2 R42.2 R48.2 U6.1(1OUT)
+3.3V: 3V3.1 D6.2(K) D8.2(K) D10.2(K) D52.2(K) D107.2(K)
+5.0V: C96.1 L2.1
+5VA: 5VA.1 C46.1 C47.2 D51.2(K) D106.2(K) L2.2 R31.1 U6.4(VCC) U24.5(VCC) U26.5(VCC)
AGND: AGND.1 C13.2 C14.1 C46.2 C47.1 C48.2 C50.1 C51.1 C52.1 C116.2 C130.1 C131.2 C132.1 C140.2 C141.2 C142.2 C144.2 C220.2 C221.2 C222.2 L3.2 R30.1 R39.2 R40.1 R45.2 R46.1 R51.2 R52.2 R135.1 R175.1 R221.2 R223.2 U6.11(GND) U7.3(E) U24.2(GND) U26.2(GND)
GND: C96.2 L3.1
P1-26: R135.2
ARM-9: A1.1 C116.1 D6.1(A) R38.2 ; port ARM-9
ARM-10: A2.1 C131.1 D8.1(A) R44.2 ; port ARM-10
ARM-11: A3.1 C132.2 D10.1(A) R50.1 ; port ARM-11
ARM-23: C222.1 D107.1(A) R225.2 ; port ARM-23
ARM-24: A4.1 C130.2 D52.1(A) R170.2 ; port ARM-24
P1-8: D5.2(K) ; port P1-8
P1-9: D7.2(K) R201.2 ; port P1-9
P1-10: D9.2(K) R202.2 ; port P1-10
P1-11: R169.1 ; port P1-11
P1-12: R221.1 R222.2 ; port P1-12
NetC13_1: C13.1 C144.1 D51.1(A) R169.2 R175.2 U24.1(1IN+)
NetC48_1: C48.1 R31.2 R32.2 U7.1(C) U7.2(B)
NetC50_2: C50.2 C140.1 D5.1(A) R33.1 R36.1 R39.1
NetC51_2: C51.2 C141.1 D7.1(A) D62.1(A) R42.1 R43.1 R45.1 R201.1
NetC52_2: C52.2 C142.1 D9.1(A) D63.1(A) R48.1 R49.1 R51.1 R202.1
NetC220_1: C220.1 C221.1 D106.1(A) R222.1 R223.1 U26.1(1IN+)
NetR29_1: R29.1 R30.2 U6.2(1IN-)
NetR32_1: R32.1 U6.3(1IN+)
NetR36_2: R36.2 U6.5(2IN+)
NetR38_1: R38.1 R41.1 U6.7(2OUT)
NetR40_2: R40.2 R41.2 U6.6(2IN-)
NetR43_2: R43.2 U6.10(3IN+)
NetR44_1: R44.1 R47.1 U6.8(3OUT)
NetR46_2: R46.2 R47.2 U6.9(3IN-)
NetR49_2: R49.2 U6.12(4IN+)
NetR50_2: R50.2 R53.2 U6.14(4OUT)
NetR52_1: R52.1 R53.1 U6.13(4IN-)
NetR170_1: R170.1 R183.1 U24.4(OUT)
NetR183_2: R183.2 U24.3(1IN-)
NetR224_1: R224.1 U26.3(1IN-)
NetR224_2: R224.2 R225.1 U26.4(OUT)

### Library data of the parts
2V5 3V3 5VA A1-A4 AGND U6 U24 U26 = Component_1
C13 C14 C46-C48 C50-C52 C96 C116 C130-C132 C140-C142 C144 C220-C222 = Cap: Capacitor; Published: 8-Jun-2000; LatestRevisionDate: 17-Jul-2002; LatestRevisionNote: Re-released for DXP Platform.; PackageReference: RAD-0.3; Publisher: Altium Limited
D5-D10 D51 D52 D62 D63 D106 D107 = Diode 1N4007: 1 Amp General Purpose Rectifier; Published: 8-Jun-2000; LatestRevisionDate: 17-Jul-2002; LatestRevisionNote: Re-released for DXP Platform.; DatasheetDocument: 1998; PackageDocument: Aug-1999; PackageReference: DO-41; Publisher: Altium Limited; Code_JEDEC: DO-204-AL; ComponentLink1Description: Manufacturer Link; ComponentLink1URL: http://www.fairchildsemi.com/; ComponentLink2Description: Datasheet; ComponentLink2URL: http://www.fairchildsemi.com/ds/1N%2F1N4001.pdf
L2 L3 = Inductor: Code_IEC: 1005; Published: 8-Jun-2000; LatestRevisionDate: 17-Jul-2002; LatestRevisionNote: Re-released for DXP Platform.; PackageReference: 0402-A; Publisher: Altium Limited; Code_JEITA: 0402
R29 R31-R33 R36 R38 R39 R41 R43-R45 R47 R49-R51 R53 R169 R170 R175 R183 R222-R225 = Res2: Resistor; Published: 8-Jun-2000; LatestRevisionDate: 17-Jul-2002; LatestRevisionNote: Re-released for DXP Platform.; PackageReference: AXIAL-0.4; Publisher: Altium Limited
R30 R40 R42 R46 R48 R52 R201 R202 R221 = Res2: Resistor; Value: NC; Published: 8-Jun-2000; LatestRevisionDate: 17-Jul-2002; LatestRevisionNote: Re-released for DXP Platform.; PackageReference: AXIAL-0.4; Publisher: Altium Limited
R135 = Res2: Resistor; Value: 0R; Published: 8-Jun-2000; LatestRevisionDate: 17-Jul-2002; LatestRevisionNote: Re-released for DXP Platform.; PackageReference: AXIAL-0.4; Publisher: Altium Limited
U7 = NPN: NPN Bipolar Transistor; Published: 8-Jun-2000; LatestRevisionDate: 17-Jul-2002; LatestRevisionNote: Re-released for DXP Platform.; PackageReference: TO-226; Publisher: Altium Limited; Code_JEDEC: TO-226-AA

## Sheet 集成隔离器（4）.SchDoc
size A4
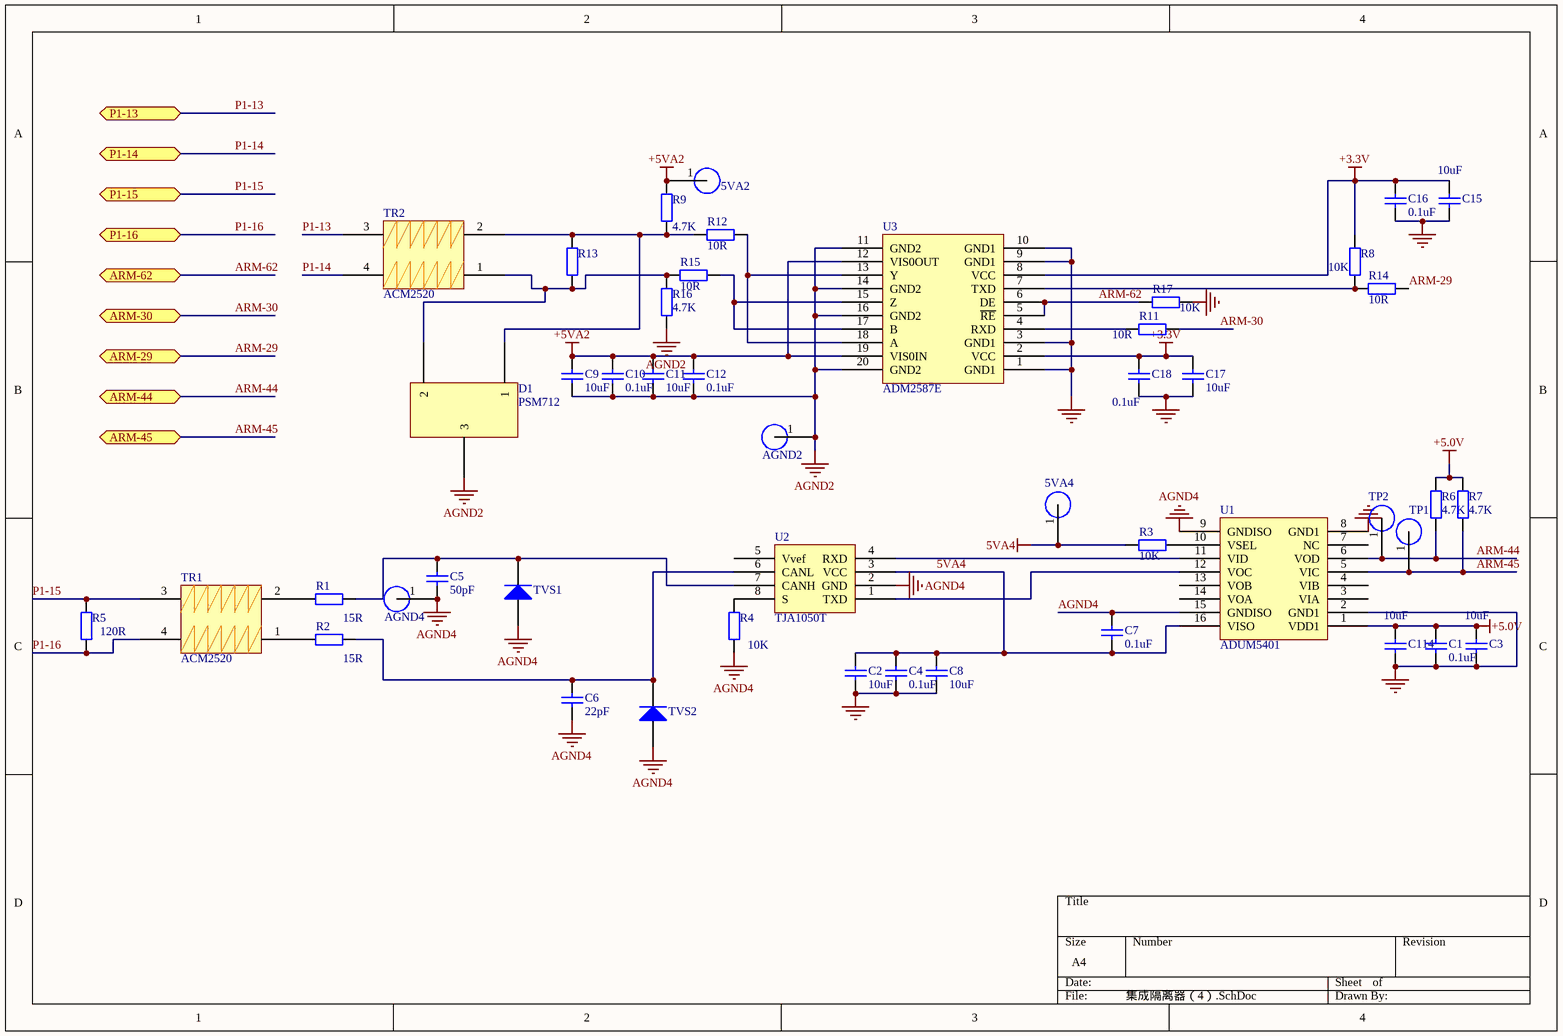
[diagram p8: 集成隔离器（4）.SchDoc]

### Parts
5VA2  PIN  [圆形焊盘]  (value not drawn)
5VA4  PIN  [圆形焊盘]  (value not drawn)
AGND2  PIN  [圆形焊盘]  (value not drawn)
AGND4  PIN  [圆形焊盘]  (value not drawn)
C1  value 0.1uF  [C0805]  (hidden comment: Cap)
C2  value 10uF  [C1206]  (hidden comment: Cap)
C3  value 10uF  [C1206]  (hidden comment: Cap)
C4  value 0.1uF  [C0805]  (hidden comment: Cap)
C5  value 50pF  [C0805]  (hidden comment: Cap)
C6  value 22pF  [C0805]  (hidden comment: Cap)
C7  value 0.1uF  [C0805]  (hidden comment: Cap)
C8  value 10uF  [C1206]  (hidden comment: Cap)
C9  value 10uF  [C1206]  (hidden comment: Cap)
C10  value 0.1uF  [C0805]  (hidden comment: Cap)
C11  value 10uF  [C1206]  (hidden comment: Cap)
C12  value 0.1uF  [C0805]  (hidden comment: Cap)
C15  value 10uF  [C1206]  (hidden comment: Cap)
C16  value 0.1uF  [C0805]  (hidden comment: Cap)
C17  value 10uF  [C1206]  (hidden comment: Cap)
C18  value 0.1uF  [C0805]  (hidden comment: Cap)
C114  value 10uF  [C1206]  (hidden comment: Cap)
D1  PSM712  [SOT23-3]
R1  value 15R  [R0805]  (hidden comment: Res2)
R2  value 15R  [R0805]  (hidden comment: Res2)
R3  value 10K  [R0805]  (hidden comment: Res2)
R4  value 10K  [R0805]  (hidden comment: Res2)
R5  value 120R  [R0805]  (hidden comment: Res2)
R6  value 4.7K  [R0805]  (hidden comment: Res2)
R7  value 4.7K  [R0805]  (hidden comment: Res2)
R8  value 10K  [R0805]  (hidden comment: Res2)
R9  value 4.7K  [R0805]  (hidden comment: Res2)
R11  value 10R  [R0805]  (hidden comment: Res2)
R12  value 10R  [R0805]  (hidden comment: Res2)
R13  Res2  [R0805]  (value not drawn)
R14  value 10R  [R0805]  (hidden comment: Res2)
R15  value 10R  [R0805]  (hidden comment: Res2)
R16  value 4.7K  [R0805]  (hidden comment: Res2)
R17  value 10K  [R0805]  (hidden comment: Res2)
TP1  PIN  [圆形焊盘]  (value not drawn)
TP2  PIN  [圆形焊盘]  (value not drawn)
TR1  ACM2520  [1008]
TR2  ACM2520  [1008]
TVS1  Diode 1N4007  [SMA]  (value not drawn)
TVS2  Diode 1N4007  [SMA]  (value not drawn)
U1  ADUM5401  [SOIC-16]
U2  TJA1050T  [SO-8]
U3  ADM2587E  [SOIC-20]

### Ports
ARM-29, ARM-30, ARM-44, ARM-45, ARM-62, P1-13, P1-14, P1-15, P1-16

### Nets
5VA4: 5VA4.1 C2.2 C4.1 C7.2 C8.2 R3.2 U1.16(VISO) U2.3(VCC)
+3.3V: C15.2 C16.1 C17.1 C18.2 R8.1 U3.2(VCC) U3.8(VCC)
+5.0V: C1.1 C3.2 C114.2 R6.1 R7.1 U1.1(VDD1)
+5VA2: 5VA2.1 C9.1 C10.1 C11.1 C12.2 R9.2 U3.12(VIS0OUT) U3.19(VIS0IN)
AGND2: AGND2.1 C9.2 C10.2 C11.2 C12.1 D1.3 R16.2 U3.11(GND2) U3.14(GND2) U3.16(GND2) U3.20(GND2)
AGND4: AGND4.1 C2.1 C4.2 C5.1 C6.2 C7.1 C8.1 R4.2 TVS1.1(A) TVS2.1(A) U1.9(GNDISO) U1.15(GNDISO) U2.2(GND)
GND: C1.2 C3.1 C15.1 C16.2 C17.2 C18.1 C114.1 R17.2 U1.2(GND1) U1.8(GND1) U3.1(GND1) U3.3(GND1) U3.9(GND1) U3.10(GND1)
ARM-29: R14.1 ; port ARM-29
ARM-30: R11.1 ; port ARM-30
ARM-44: R6.2 TP2.1 U1.6(VOD) ; port ARM-44
ARM-45: R7.2 TP1.1 U1.5(VIC) ; port ARM-45
ARM-62: R17.1 U3.5(~{RE}) U3.6(DE) ; port ARM-62
P1-13: TR2.3 ; port P1-13
P1-14: TR2.4 ; port P1-14
P1-15: R5.2 TR1.3 ; port P1-15
P1-16: R5.1 TR1.4 ; port P1-16
NetC5_2: C5.2 R1.1 TVS1.2(K) U2.7(CANH)
NetC6_1: C6.1 R2.1 TVS2.2(K) U2.6(CANL)
NetD1_1: D1.1 R9.1 R12.1 R13.2 TR2.2
NetD1_2: D1.2 R13.1 R15.1 R16.1 TR2.1
NetR1_2: R1.2 TR1.2
NetR2_2: R2.2 TR1.1
NetR3_1: R3.1 U1.10(VSEL)
NetR4_1: R4.1 U2.8(S)
NetR8_2: R8.2 R14.2 U3.7(TXD)
NetR11_2: R11.2 U3.4(RXD)
NetR12_2: R12.2 U3.13(Y) U3.18(A)
NetR15_2: R15.2 U3.15(Z) U3.17(B)
NetU1_11: U1.11(VID) U2.4(RXD)
NetU1_12: U1.12(VOC) U2.1(TXD)

Not connected (* = marked no-connect by the designer): U1 3(VIA) 4(VIB) 7(NC) 13(VOB) 14(VOA); U2 5(Vvef)

### Library data of the parts
5VA2 5VA4 AGND2 AGND4 D1 TP1 TP2 TR1 TR2 U1-U3 = Component_1
C1-C12 C15-C18 C114 = Cap: Capacitor; Published: 8-Jun-2000; LatestRevisionDate: 17-Jul-2002; LatestRevisionNote: Re-released for DXP Platform.; PackageReference: RAD-0.3; Publisher: Altium Limited
R1-R9 R11 R12 R14-R17 = Res2: Resistor; Published: 8-Jun-2000; LatestRevisionDate: 17-Jul-2002; LatestRevisionNote: Re-released for DXP Platform.; PackageReference: AXIAL-0.4; Publisher: Altium Limited
R13 = Res2: Resistor; Value: NC; Published: 8-Jun-2000; LatestRevisionDate: 17-Jul-2002; LatestRevisionNote: Re-released for DXP Platform.; PackageReference: AXIAL-0.4; Publisher: Altium Limited
TVS1 TVS2 = Diode 1N4007: 1 Amp General Purpose Rectifier; Published: 8-Jun-2000; LatestRevisionDate: 17-Jul-2002; LatestRevisionNote: Re-released for DXP Platform.; DatasheetDocument: 1998; PackageDocument: Aug-1999; PackageReference: DO-41; Publisher: Altium Limited; Code_JEDEC: DO-204-AL; ComponentLink1Description: Manufacturer Link; ComponentLink1URL: http://www.fairchildsemi.com/; ComponentLink2Description: Datasheet; ComponentLink2URL: http://www.fairchildsemi.com/ds/1N%2F1N4001.pdf

## Sheet 输出运算放大器（5）.SchDoc
size A4
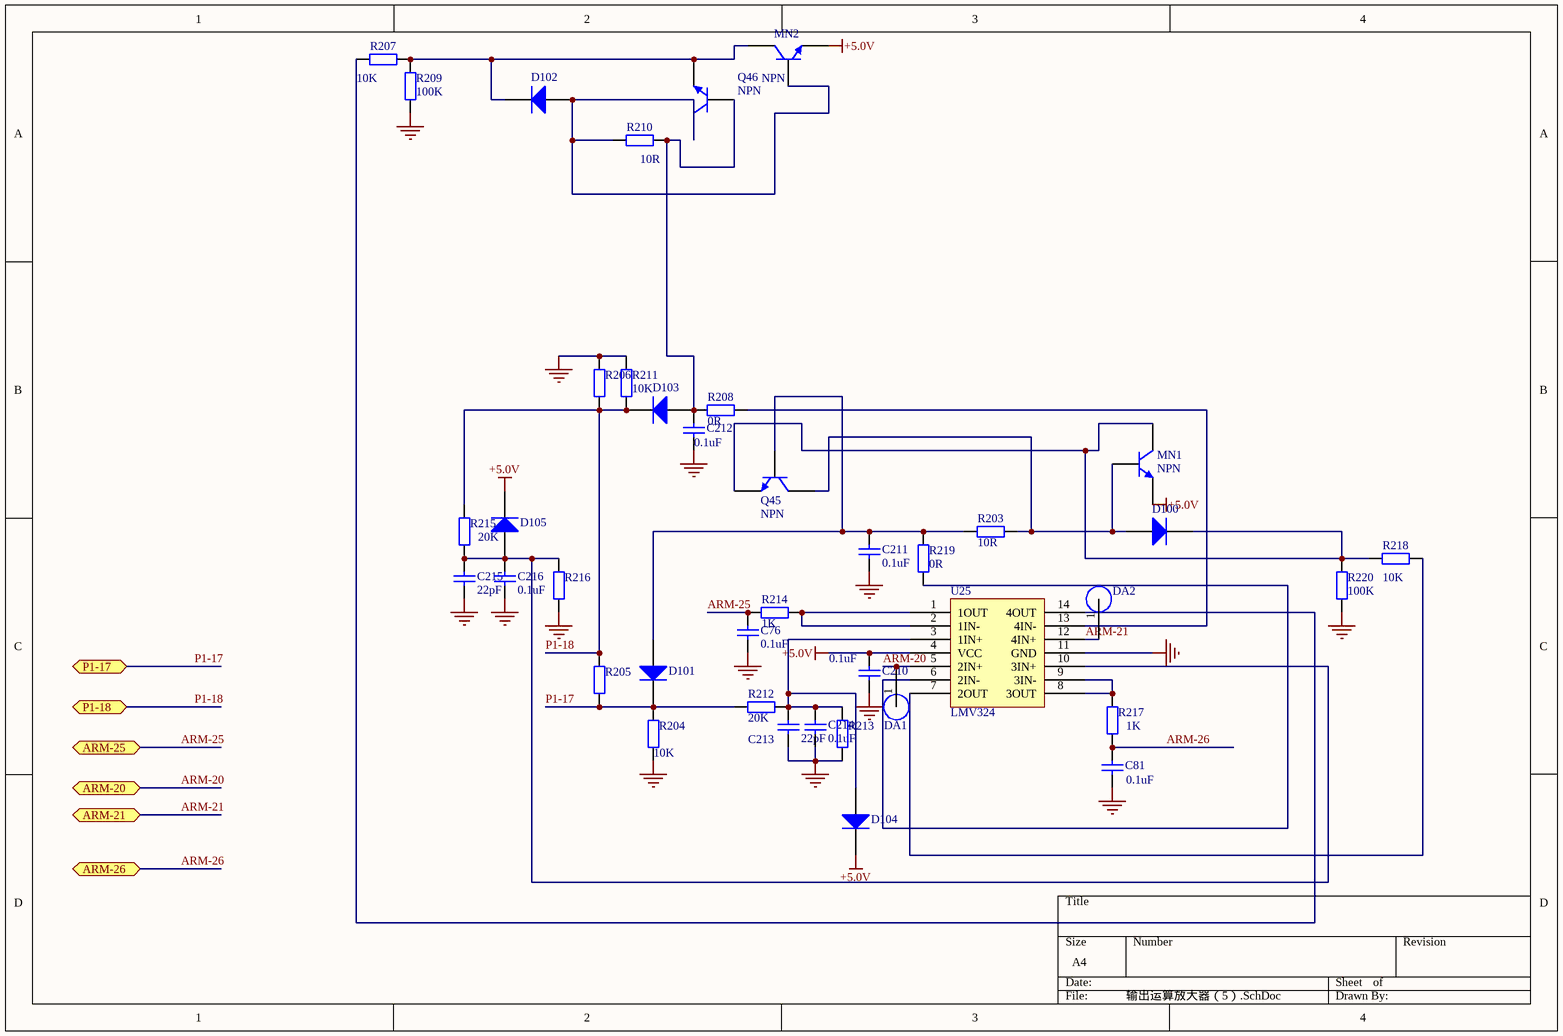
[diagram p9: 输出运算放大器（5）.SchDoc]

### Parts
C76  value 0.1uF  [C0805]  (hidden comment: Cap)
C81  value 0.1uF  [C0805]  (hidden comment: Cap)
C210  value 0.1uF  [C0805]  (hidden comment: Cap)
C211  value 0.1uF  [C0805]  (hidden comment: Cap)
C212  value 0.1uF  [C0805]  (hidden comment: Cap)
C213  value 22pF  [C0805]  (hidden comment: Cap)
C214  value 0.1uF  [C0805]  (hidden comment: Cap)
C215  value 22pF  [C0805]  (hidden comment: Cap)
C216  value 0.1uF  [C0805]  (hidden comment: Cap)
D100  Diode 1N4007  [SOD123]  (value not drawn)
D101  Diode 1N4007  [SMA]  (value not drawn)
D102  Diode 1N4007  [SOD123]  (value not drawn)
D103  Diode 1N4007  [SMA]  (value not drawn)
D104  Diode 1N4007  [SOD123]  (value not drawn)
D105  Diode 1N4007  [SOD123]  (value not drawn)
DA1  PIN  [圆形焊盘]  (value not drawn)
DA2  PIN  [圆形焊盘]  (value not drawn)
MN1  NPN  [SOT23-3]
MN2  NPN  [MN2]
Q45  NPN  [Q45]
Q46  NPN  [Q46]
R203  value 10R  [R1206]  (hidden comment: Res2)
R204  value 10K  [R0805]  (hidden comment: Res2)
R205  Res2  [R1206]  (value not drawn)
R206  Res2  [R1206]  (value not drawn)
R207  value 10K  [R0805]  (hidden comment: Res2)
R208  value 0R  [R0805]  (hidden comment: Res2)
R209  value 100K  [R0805]  (hidden comment: Res2)
R210  value 10R  [R1206]  (hidden comment: Res2)
R211  value 10K  [R0805]  (hidden comment: Res2)
R212  value 20K  [R0805]  (hidden comment: Res2)
R213  Res2  [R0805]  (value not drawn)
R214  value 1K  [R0805]  (hidden comment: Res2)
R215  value 20K  [R0805]  (hidden comment: Res2)
R216  Res2  [R0805]  (value not drawn)
R217  value 1K  [R0805]  (hidden comment: Res2)
R218  value 10K  [R0805]  (hidden comment: Res2)
R219  value 0R  [R0805]  (hidden comment: Res2)
R220  value 100K  [R0805]  (hidden comment: Res2)
U25  LMV324  [SOP-14]

### Ports
ARM-20, ARM-21, ARM-25, ARM-26, P1-17, P1-18

### Nets
+5.0V: C210.1 D104.2(K) D105.2(K) MN1.3(E) MN2.3(E) U25.4(VCC)
GND: C76.1 C81.1 C210.2 C211.2 C212.2 C213.1 C214.1 C215.1 C216.1 R204.2 R206.2 R209.2 R211.2 R213.1 R216.1 R220.1 U25.11(GND)
ARM-20: DA1.1 U25.5(2IN+) ; port ARM-20
ARM-21: DA2.1 U25.12(4IN+) ; port ARM-21
ARM-25: C76.2 R214.1 ; port ARM-25
ARM-26: C81.2 R217.1 ; port ARM-26
P1-17: D101.2(K) R204.1 R205.1 R212.1 ; port P1-17
P1-18: D103.2(K) R205.2 R206.1 R211.1 R215.1 ; port P1-18
NetC211_1: C211.1 D101.1(A) Q45.2(B) R203.1 R219.2
NetC212_1: C212.1 D103.1(A) Q46.2(B) R208.2 R210.2
NetC213_2: C213.2 C214.2 D104.1(A) R212.2 R213.2 U25.3(1IN+)
NetC215_2: C215.2 C216.2 D105.1(A) R215.2 R216.2 U25.10(3IN+)
NetD100_1: D100.1(A) MN1.2(B) Q45.1(C) R203.2
NetD100_2: D100.2(K) MN1.1(C) Q45.3(E) R218.2 R220.2
NetD102_1: D102.1(A) MN2.2(B) Q46.1(C) R210.1
NetD102_2: D102.2(K) MN2.1(C) Q46.3(E) R207.2 R209.1
NetR207_1: R207.1 U25.14(4OUT)
NetR208_1: R208.1 U25.13(4IN-)
NetR214_2: R214.2 U25.1(1OUT) U25.2(1IN-)
NetR217_2: R217.2 U25.8(3OUT) U25.9(3IN-)
NetR218_1: R218.1 U25.7(2OUT)
NetR219_1: R219.1 U25.6(2IN-)

### Library data of the parts
C76 C81 C210-C216 = Cap: Capacitor; Published: 8-Jun-2000; LatestRevisionDate: 17-Jul-2002; LatestRevisionNote: Re-released for DXP Platform.; PackageReference: RAD-0.3; Publisher: Altium Limited
D100-D105 = Diode 1N4007: 1 Amp General Purpose Rectifier; Published: 8-Jun-2000; LatestRevisionDate: 17-Jul-2002; LatestRevisionNote: Re-released for DXP Platform.; DatasheetDocument: 1998; PackageDocument: Aug-1999; PackageReference: DO-41; Publisher: Altium Limited; Code_JEDEC: DO-204-AL; ComponentLink1Description: Manufacturer Link; ComponentLink1URL: http://www.fairchildsemi.com/; ComponentLink2Description: Datasheet; ComponentLink2URL: http://www.fairchildsemi.com/ds/1N%2F1N4001.pdf
DA1 DA2 U25 = Component_1
MN1 MN2 Q45 Q46 = NPN: NPN Bipolar Transistor; Published: 8-Jun-2000; LatestRevisionDate: 17-Jul-2002; LatestRevisionNote: Re-released for DXP Platform.; PackageReference: TO-226; Publisher: Altium Limited; Code_JEDEC: TO-226-AA
R203 R204 R207-R212 R214 R215 R217-R220 = Res2: Resistor; Published: 8-Jun-2000; LatestRevisionDate: 17-Jul-2002; LatestRevisionNote: Re-released for DXP Platform.; PackageReference: AXIAL-0.4; Publisher: Altium Limited
R205 R206 R213 R216 = Res2: Resistor; Value: NC; Published: 8-Jun-2000; LatestRevisionDate: 17-Jul-2002; LatestRevisionNote: Re-released for DXP Platform.; PackageReference: AXIAL-0.4; Publisher: Altium Limited

## Sheet 输出放大（6）.SchDoc
size A4
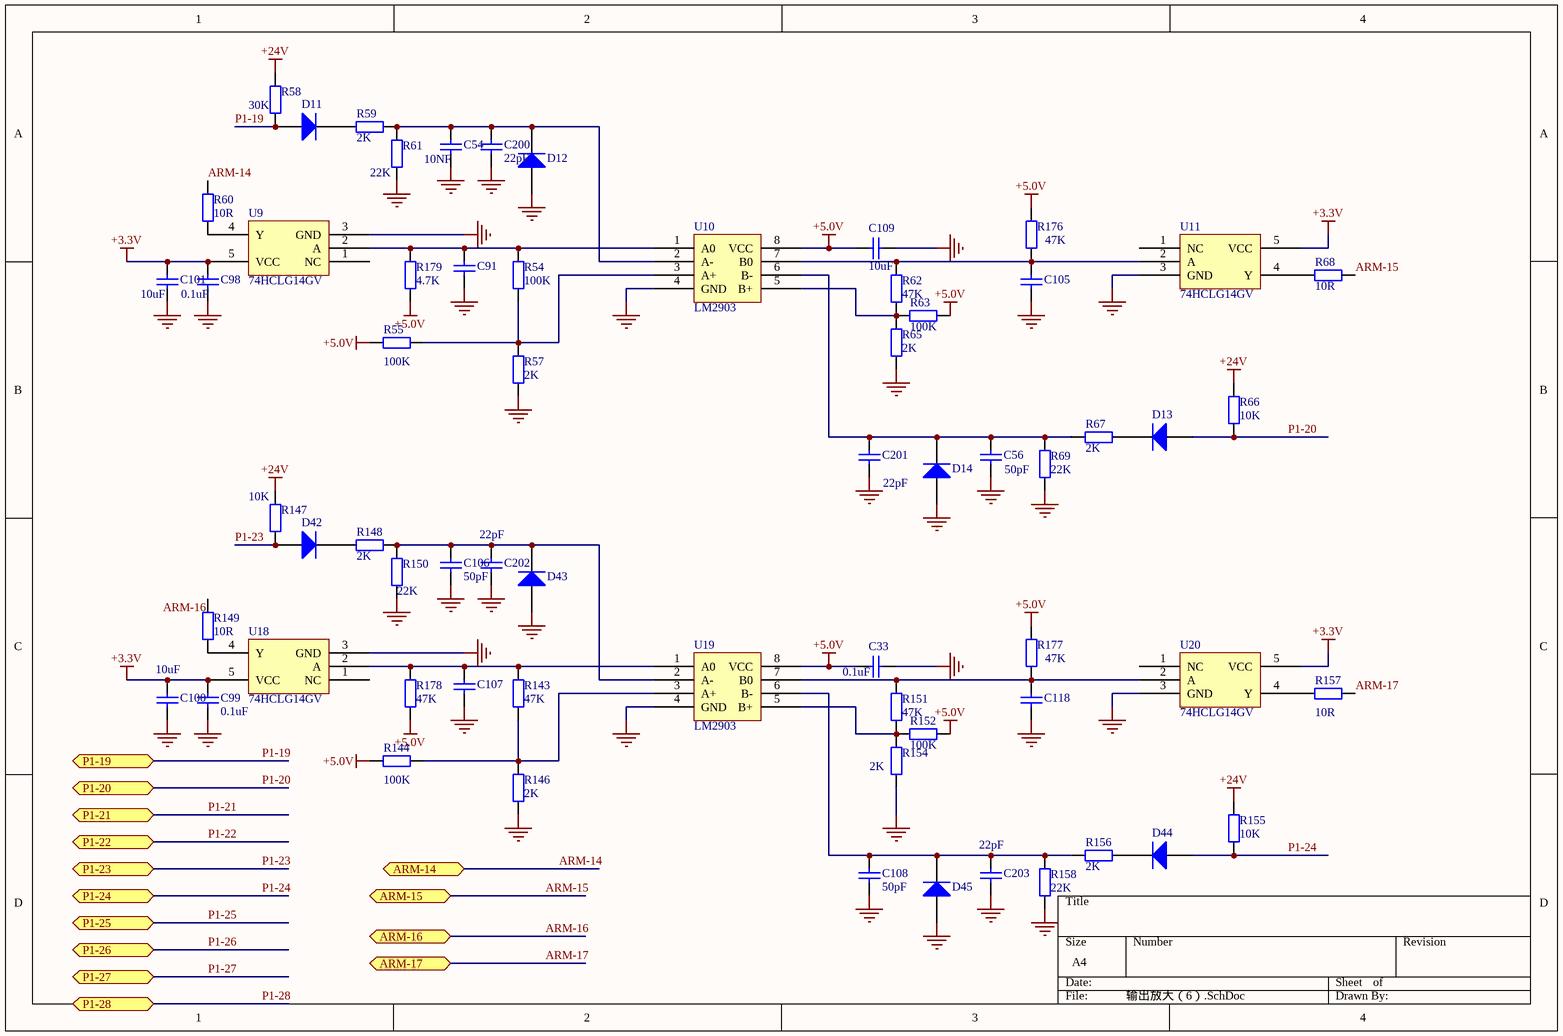
[diagram p10: 输出放大（6）.SchDoc]

### Parts
C33  value 0.1uF  [C0805]  (hidden comment: Cap)
C54  value 10NF  [C0805]  (hidden comment: Cap)
C56  value 50pF  [C0805]  (hidden comment: Cap)
C91  Cap  [C0805]  (value not drawn)
C98  value 0.1uF  [C0805]  (hidden comment: Cap)
C99  value 0.1uF  [C0805]  (hidden comment: Cap)
C100  value 10uF  [C1206]  (hidden comment: Cap)
C101  value 10uF  [C1206]  (hidden comment: Cap)
C105  Cap  [C0805]  (value not drawn)
C106  value 50pF  [C0805]  (hidden comment: Cap)
C107  Cap  [C0805]  (value not drawn)
C108  value 50pF  [C0805]  (hidden comment: Cap)
C109  value 10uF  [C1206]  (hidden comment: Cap)
C118  Cap  [C0805]  (value not drawn)
C200  value 22pF  [C0805]  (hidden comment: Cap)
C201  value 22pF  [C0805]  (hidden comment: Cap)
C202  value 22pF  [C0805]  (hidden comment: Cap)
C203  value 22pF  [C0805]  (hidden comment: Cap)
D11  Diode 1N4007  [SOD123]  (value not drawn)
D12  Diode 1N4007  [SOD123]  (value not drawn)
D13  Diode 1N4007  [SOD123]  (value not drawn)
D14  Diode 1N4007  [SOD123]  (value not drawn)
D42  Diode 1N4007  [SOD123]  (value not drawn)
D43  Diode 1N4007  [SOD123]  (value not drawn)
D44  Diode 1N4007  [SOD123]  (value not drawn)
D45  Diode 1N4007  [SOD123]  (value not drawn)
R54  value 100K  [R0805]  (hidden comment: Res2)
R55  value 100K  [R0805]  (hidden comment: Res2)
R57  value 2K  [R0805]  (hidden comment: Res2)
R58  value 30K  [R0805]  (hidden comment: Res2)
R59  value 2K  [R0805]  (hidden comment: Res2)
R60  value 10R  [R0805]  (hidden comment: Res2)
R61  value 22K  [R0805]  (hidden comment: Res2)
R62  value 47K  [R0805]  (hidden comment: Res2)
R63  value 100K  [R0805]  (hidden comment: Res2)
R65  value 2K  [R0805]  (hidden comment: Res2)
R66  value 10K  [R0805]  (hidden comment: Res2)
R67  value 2K  [R0805]  (hidden comment: Res2)
R68  value 10R  [R0805]  (hidden comment: Res2)
R69  value 22K  [R0805]  (hidden comment: Res2)
R143  value 47K  [R0805]  (hidden comment: Res2)
R144  value 100K  [R0805]  (hidden comment: Res2)
R146  value 2K  [R0805]  (hidden comment: Res2)
R147  value 10K  [R0805]  (hidden comment: Res2)
R148  value 2K  [R0805]  (hidden comment: Res2)
R149  value 10R  [R0805]  (hidden comment: Res2)
R150  value 22K  [R0805]  (hidden comment: Res2)
R151  value 47K  [R0805]  (hidden comment: Res2)
R152  value 100K  [R0805]  (hidden comment: Res2)
R154  value 2K  [R0805]  (hidden comment: Res2)
R155  value 10K  [R0805]  (hidden comment: Res2)
R156  value 2K  [R0805]  (hidden comment: Res2)
R157  value 10R  [R0805]  (hidden comment: Res2)
R158  value 22K  [R0805]  (hidden comment: Res2)
R176  value 47K  [R0805]  (hidden comment: Res2)
R177  value 47K  [R0805]  (hidden comment: Res2)
R178  value 47K  [R0805]  (hidden comment: Res2)
R179  value 4.7K  [R0805]  (hidden comment: Res2)
U9  74HCLG14GV  [SOT23-5]
U10  LM2903  [SO-8]
U11  74HCLG14GV  [SOT23-5]
U18  74HCLG14GV  [SOT23-5]
U19  LM2903  [SO-8]
U20  74HCLG14GV  [SOT23-5]

### Ports
ARM-14, ARM-15, ARM-16, ARM-17, P1-19, P1-20, P1-21, P1-22, P1-23, P1-24, P1-25, P1-26, P1-27, P1-28

### Nets
+3.3V: C98.2 C99.1 C100.2 C101.2 U9.5(VCC) U11.5(VCC) U18.5(VCC) U20.5(VCC)
+5.0V: C33.2 C109.1 R55.2 R63.2 R144.2 R152.2 R176.1 R177.1 R178.1 R179.1 U10.8(VCC) U19.8(VCC)
+24V: R58.2 R66.1 R147.2 R155.1
GND: C33.1 C54.1 C56.2 C91.2 C98.1 C99.2 C100.1 C101.1 C105.2 C106.2 C107.1 C108.1 C109.2 C118.1 C200.2 C201.2 C202.1 C203.2 D12.1(A) D14.1(A) D43.1(A) D45.1(A) R57.1 R61.1 R65.1 R69.2 R146.1 R150.1 R154.2 R158.2 U9.3(GND) U10.4(GND) U11.3(GND) U18.3(GND) U19.4(GND) U20.3(GND)
ARM-14: R60.1 ; port ARM-14
ARM-15: R68.1 ; port ARM-15
ARM-16: R149.1 ; port ARM-16
ARM-17: R157.2 ; port ARM-17
P1-19: D11.1(A) R58.1 ; port P1-19
P1-20: D13.1(A) R66.2 ; port P1-20
P1-23: D42.1(A) R147.1 ; port P1-23
P1-24: D44.1(A) R155.2 ; port P1-24
NetC54_2: C54.2 C200.1 D12.2(K) R59.2 R61.2 U10.2(A-)
NetC56_1: C56.1 C201.1 D14.2(K) R67.1 R69.1 U10.6(B-)
NetC91_1: C91.1 R54.1 R179.2 U9.2(A) U10.1(A0)
NetC105_1: C105.1 R62.2 R176.2 U10.7(B0) U11.2(A)
NetC106_1: C106.1 C202.2 D43.2(K) R148.2 R150.2 U19.2(A-)
NetC107_2: C107.2 R143.1 R178.2 U18.2(A) U19.1(A0)
NetC108_2: C108.2 C203.1 D45.2(K) R156.1 R158.1 U19.6(B-)
NetC118_2: C118.2 R151.2 R177.2 U19.7(B0) U20.2(A)
NetD11_2: D11.2(K) R59.1
NetD13_2: D13.2(K) R67.2
NetD42_2: D42.2(K) R148.1
NetD44_2: D44.2(K) R156.2
NetR54_2: R54.2 R55.1 R57.2 U10.3(A+)
NetR60_2: R60.2 U9.4(Y)
NetR62_1: R62.1 R63.1 R65.2 U10.5(B+)
NetR68_2: R68.2 U11.4(Y)
NetR143_2: R143.2 R144.1 R146.2 U19.3(A+)
NetR149_2: R149.2 U18.4(Y)
NetR151_1: R151.1 R152.1 R154.1 U19.5(B+)
NetR157_1: R157.1 U20.4(Y)

Not connected (* = marked no-connect by the designer): U9 1(NC); U11 1(NC); U18 1(NC); U20 1(NC)

### Library data of the parts
C33 C54 C56 C98-C101 C106 C108 C109 C200-C203 = Cap: Capacitor; Published: 8-Jun-2000; LatestRevisionDate: 17-Jul-2002; LatestRevisionNote: Re-released for DXP Platform.; PackageReference: RAD-0.3; Publisher: Altium Limited
C91 C105 C107 C118 = Cap: Capacitor; Value: NC; Published: 8-Jun-2000; LatestRevisionDate: 17-Jul-2002; LatestRevisionNote: Re-released for DXP Platform.; PackageReference: RAD-0.3; Publisher: Altium Limited
D11-D14 D42-D45 = Diode 1N4007: 1 Amp General Purpose Rectifier; Published: 8-Jun-2000; LatestRevisionDate: 17-Jul-2002; LatestRevisionNote: Re-released for DXP Platform.; DatasheetDocument: 1998; PackageDocument: Aug-1999; PackageReference: DO-41; Publisher: Altium Limited; Code_JEDEC: DO-204-AL; ComponentLink1Description: Manufacturer Link; ComponentLink1URL: http://www.fairchildsemi.com/; ComponentLink2Description: Datasheet; ComponentLink2URL: http://www.fairchildsemi.com/ds/1N%2F1N4001.pdf
R54 R55 R57-R63 R65-R69 R143 R144 R146-R152 R154-R158 R176-R179 = Res2: Resistor; Published: 8-Jun-2000; LatestRevisionDate: 17-Jul-2002; LatestRevisionNote: Re-released for DXP Platform.; PackageReference: AXIAL-0.4; Publisher: Altium Limited
U9-U11 U18-U20 = Component_1